# EAGLE board Led_Driver_90_B1 (EAGLE 6.4), part 1 of 2
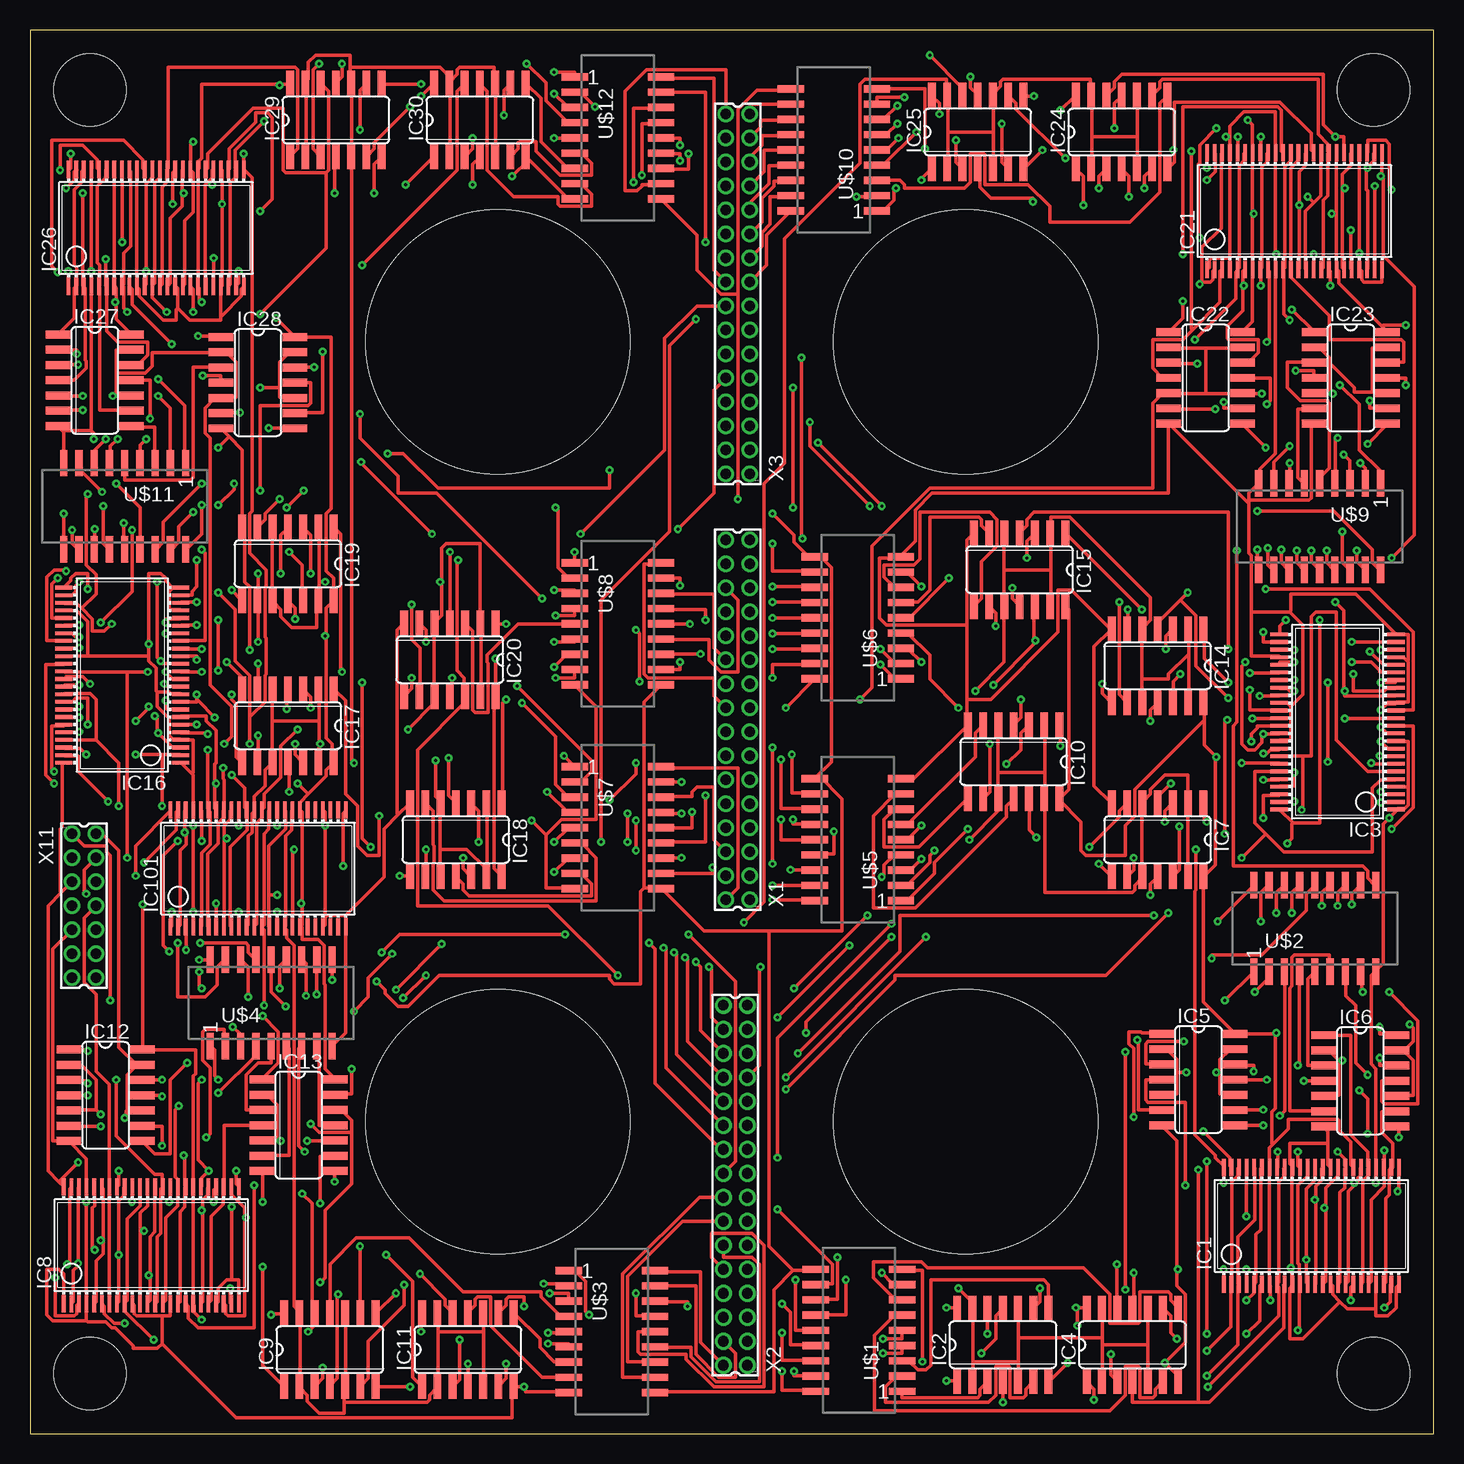
[diagram p10: board, top side]
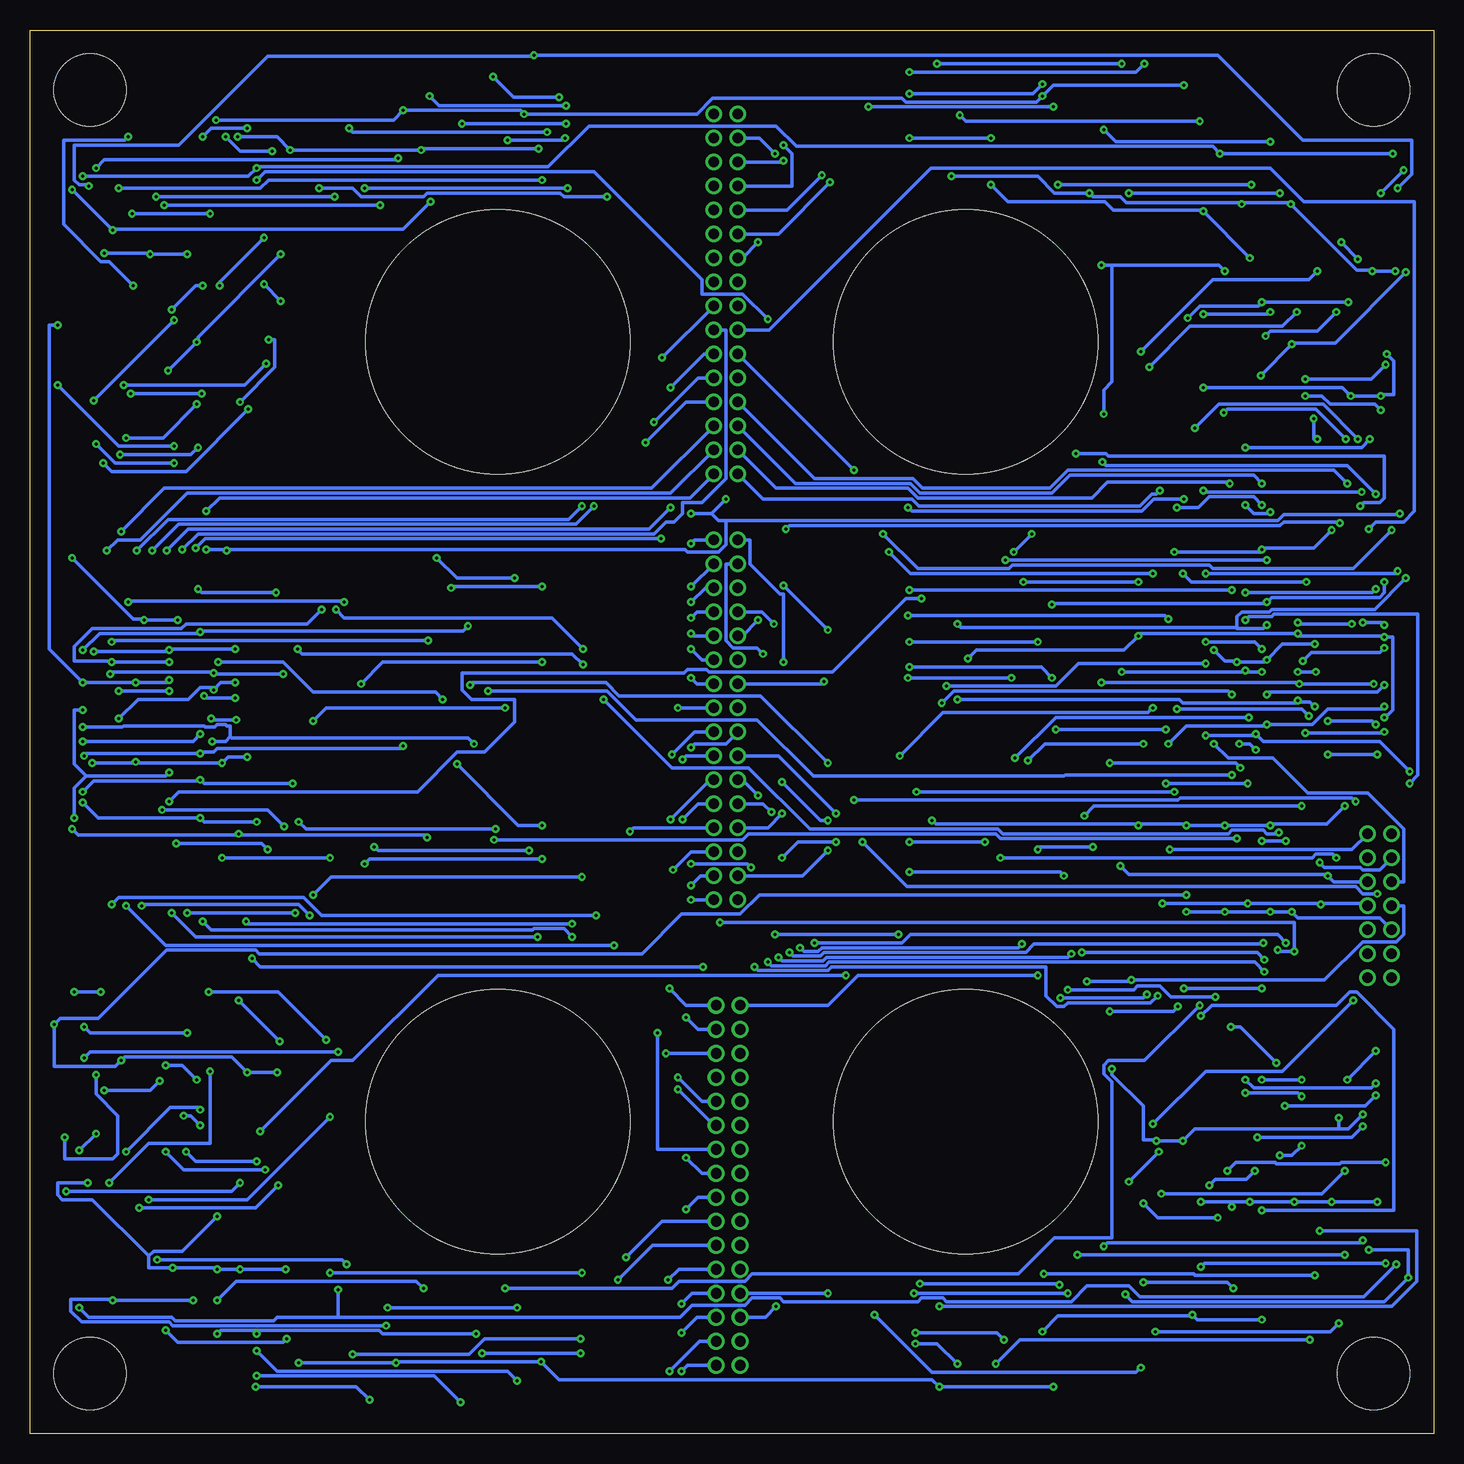
[diagram p11: board, bottom side, seen from below]

Size 117 x 117 mm. Coordinates in mm from the lower left corner, seen from the top.
Outline: 0,0 117,0 117,117 0,117 0,0
Copper layers (1*16): Top 0.1041mm / dielectric 1mm / Bottom 0.1041mm
Design rules "2_layer_board *": minimum track width 0.3mm, minimum drill 0.25mm, track to track 0.1mm, track to pad 0.1mm, pad to pad 0.1mm, via to via 0.2mm, smd to smd 0.1mm, copper to edge 1mm, drill to drill 0.2mm, minimum pad ring 10mil, minimum via ring 8mil, stop-mask expansion 4mil, vias tented up to drill 0mil, thermal gap 10mil
Holes 22 mm at 39,91 39,26 78,26 78,91
Holes 6 mm at 5,112 5,5 112,112 112,5

## Footprints (pad centres in the part's own frame; a part is rotated, then mirrored left to right if it is on the bottom)
SSOP48DL = smd 0.305 x 1.422: 1 -6.985,-4.877; 2 -6.35,-4.877; 3 -5.715,-4.877; 4 -5.08,-4.877; 5 -4.445,-4.877; 6 -3.81,-4.877; 7 -3.175,-4.877; 8 -2.54,-4.877; 9 -1.905,-4.877; 10 -1.27,-4.877; 11 -0.635,-4.877; 12 0,-4.877; 13 0.635,-4.877; 14 1.27,-4.877; 15 1.905,-4.877; 16 2.54,-4.877; 17 3.175,-4.877; 18 3.81,-4.877; 19 4.445,-4.877; 20 5.08,-4.877; 21 5.715,-4.877; 22 6.35,-4.877; 23 6.985,-4.877; 24 7.62,-4.877; 25 7.62,4.877; 26 6.985,4.877; 27 6.35,4.877; 28 5.715,4.877; 29 5.08,4.877; 30 4.445,4.877; 31 3.81,4.877; 32 3.175,4.877; 33 2.54,4.877; 34 1.905,4.877; 35 1.27,4.877; 36 0.635,4.877; 37 0,4.877; 38 -0.635,4.877; 39 -1.27,4.877; 40 -1.905,4.877; 41 -2.54,4.877; 42 -3.175,4.877; 43 -3.81,4.877; 44 -4.445,4.877; 45 -5.08,4.877; 46 -5.715,4.877; 47 -6.35,4.877; 48 -6.985,4.877
SO14 = smd 0.66 x 2.032: 1 -3.81,-3.073; 2 -2.54,-3.073; 3 -1.27,-3.073; 4 0,-3.073; 5 1.27,-3.073; 6 2.54,-3.073; 7 3.81,-3.073; 8 3.81,3.073; 9 2.54,3.073; 10 1.27,3.073; 11 0,3.073; 12 -1.27,3.073; 13 -2.54,3.073; 14 -3.81,3.073
SOP-18 = smd 0.6 x 2.2: 1 -5.08,-3.6; 2 -3.81,-3.6; 3 -2.54,-3.6; 4 -1.27,-3.6; 5 0,-3.6; 6 1.27,-3.6; 7 2.54,-3.6; 8 3.81,-3.6; 9 5.08,-3.6; 10 5.08,3.6; 11 3.81,3.6; 12 2.54,3.6; 13 1.27,3.6; 14 0,3.6; 15 -1.27,3.6; 16 -2.54,3.6; 17 -3.81,3.6; 18 -5.08,3.6
87758-3216 = drill 0.9 pad 1.27: 1 -15,-1; 2 -15,1; 3 -13,-1; 4 -13,1; 5 -11,-1; 6 -11,1; 7 -9,-1; 8 -9,1; 9 -7,-1; 10 -7,1; 11 -5,-1; 12 -5,1; 13 -3,-1; 14 -3,1; 15 -1,-1; 16 -1,1; 17 1,-1; 18 1,1; 19 3,-1; 20 3,1; 21 5,-1; 22 5,1; 23 7,-1; 24 7,1; 25 9,-1; 26 9,1; 27 11,-1; 28 11,1; 29 13,-1; 30 13,1; 31 15,-1; 32 15,1
87758-1416 = drill 0.9 pad 1.27: 1 -6,-1; 2 -6,1; 3 -4,-1; 4 -4,1; 5 -2,-1; 6 -2,1; 7 0,-1; 8 0,1; 9 2,-1; 10 2,1; 11 4,-1; 12 4,1; 13 6,-1; 14 6,1

## Placement (x,y rotation side)
IC1  74AC16374  [SSOP48DL]  106.5,17.3 0 top
IC2  74S08D  [SO14]  81.1,7.4 0 top
IC3  74AC16374  [SSOP48DL]  109,59 90 top
IC4  74S08D  [SO14]  91.9,7.4 0 top
IC5  74S08D  [SO14]  97.4,29.5 270 top
IC6  74S08D  [SO14]  110.9,29.4 270 top
IC7  74S08D  [SO14]  94,49.5 180 top
IC8  74AC16374  [SSOP48DL]  9.8,15.7 0 top
IC9  74S08D  [SO14]  25,7 0 top
IC10  74S08D  [SO14]  82,56 180 top
IC11  74S08D  [SO14]  36.5,7 0 top
IC12  74S08D  [SO14]  6.3,28.2 270 top
IC13  74S08D  [SO14]  22.4,25.7 270 top
IC14  74S08D  [SO14]  94,64 180 top
IC15  74S08D  [SO14]  82.5,72 180 top
IC16  74AC16374  [SSOP48DL]  7.7,62.9 90 top
IC17  74S08D  [SO14]  21.5,59 180 top
IC18  74S08D  [SO14]  35.5,49.5 180 top
IC19  74S08D  [SO14]  21.5,72.5 180 top
IC20  74S08D  [SO14]  35,64.5 180 top
IC21  74AC16374  [SSOP48DL]  105.1,101.9 0 top
IC22  74S08D  [SO14]  98,88 270 top
IC23  74S08D  [SO14]  110.1,88 270 top
IC24  74S08D  [SO14]  91,108.5 0 top
IC25  74S08D  [SO14]  79,108.5 0 top
IC26  74AC16374  [SSOP48DL]  10.2,100.5 0 top
IC27  74S08D  [SO14]  5.4,87.8 270 top
IC28  74S08D  [SO14]  19,87.6 270 top
IC29  74S08D  [SO14]  25.5,109.5 0 top
IC30  74S08D  [SO14]  37.5,109.5 0 top
IC101  74AC16374  [SSOP48DL]  18.7,47.1 0 top
U$1  ULN2804-SM  [SOP-18]  69.1,8.6 90 top
U$2  ULN2804-SM  [SOP-18]  107.1,42.1 0 top
U$3  ULN2804-SM  [SOP-18]  48.5,8.5 270 top
U$4  ULN2804-SM  [SOP-18]  20.1,35.9 0 top
U$5  ULN2804-SM  [SOP-18]  69,49.5 90 top
U$6  ULN2804-SM  [SOP-18]  69,68 90 top
U$7  ULN2804-SM  [SOP-18]  49,50.5 270 top
U$8  ULN2804-SM  [SOP-18]  49,67.5 270 top
U$9  ULN2804-SM  [SOP-18]  107.5,75.6 180 top
U$10  ULN2804-SM  [SOP-18]  67,107 90 top
U$11  ULN2804-SM  [SOP-18]  7.9,77.3 180 top
U$12  ULN2804-SM  [SOP-18]  49,108 270 top
X1  87758-3216  [87758-3216]  59,59.5 90 top
X2  87758-3216  [87758-3216]  58.8,20.7 90 top
X3  87758-3216  [87758-3216]  59,95 90 top
X11  87758-1416  [87758-1416]  4.5,44 270 top

## Tracks (layer width: path | path; a pad name or v marks a point on that pad's centre or on a via)
GND  (via drill 0.25)
  Top 0.3: IC26.39 8.9,105.3 8.9,95.7 IC26.10 9,95.5 9.1,95.4 9.1,94.8 11.1,92.8 12.2,92.8 12.2,93.7 12.3,93.8 | 12.3,93.8 12.3,95.5 12.2,95.6 IC26.15 | 12.3,93.8 13.3,92.8 15.9,92.8 15.9,93.2 | 15.9,93.2 15.9,95.6 IC26.21 16,95.7 v16,102.5 16,105.3 IC26.28 | IC26.24 17.8,95.6 17.6,95.4 17.6,94.8 16,93.2 15.9,93.2 | U$12.9 45.4,103 44.8,103 41.4,106.4 IC30.7 41.5,106.1 v40.2,104.8 | 2.8,83.5 2.4,83.9 IC27.7 | 2.8,83.5 2.8,80.9 U$11.9 | v3.2,96.9 3.2,95.7 IC26.1 | IC26.45 5.1,105.3 v5.1,96.9 5.1,95.7 IC26.4 5.1,95.5 5.1,83.6 | v11.9,102.5 11.9,105.1 12.1,105.3 IC26.34 | v28.7,103.4 28.7,105.8 29.3,106.4 IC29.7 | 5.1,83.6 2.9,83.6 2.8,83.5 | 24.7,43.1 24.8,43.2 26.3,43.2 | 24.7,43.1 24.6,43 24.6,42.4 24.5,42.3 IC101.21 | 26.3,43.2 26.3,42.3 IC101.24 26.3,42.1 26.3,33.4 25.2,32.3 U$4.9 | IC101.28 24.5,51.9 24.6,51.8 v24.6,50.7 24.6,43.2 24.7,43.1 | 30.7,51.6 29.5,50.4 29.5,46.4 26.3,43.2 | 30.7,51.6 31.6,52.5 IC18.7 | IC20.7 31.1,67.5 30.6,67 30.6,51.7 30.7,51.6 | 16.8,12.8 17.4,12.8 17.4,10.9 IC8.24 | 16.8,12.8 16.4,12.8 15.7,12.1 15.7,11 15.6,10.9 IC8.21 | v8.5,19.3 8.5,20.5 IC8.39 | v11.6,19.3 11.7,19.4 11.7,20.5 IC8.34 | v15.3,19.3 15.3,20.3 15.5,20.5 IC8.28 | v19.4,19.3 19.4,21.8 IC13.7 | v16.8,18.9 16.8,12.8 | 11,9.8 11.7,9.8 11.7,10.8 IC8.15 | 11,9.8 8.9,9.8 8.7,10 8.7,10.7 8.6,10.8 IC8.10 | 4.7,9.4 1.9,9.4 1.4,9.9 1.4,13.7 2.4,13.7 2.8,13.3 2.8,10.9 IC8.1 | 4.7,9.4 4.7,10.8 IC8.4 4.7,10.9 v4.7,19.3 4.7,20.5 IC8.45 4.7,20.6 4.7,22.9 3.3,24.3 IC12.7 3.1,24.4 1.9,24.4 1.9,40.4 X11.9 | 11,7.5 11,9.8 | 11,7.5 10.6,7.1 8.6,7.1 8.6,7.3 7.1,8.8 6.8,8.8 6.3,9.3 4.8,9.3 4.7,9.4 | 43,49.9 43,45.5 45.4,45.5 U$7.9
  Top 0.3: 43,49.9 44.3,51.2 47.2,51.2 47.2,60.6 45.4,62.4 U$8.9 | v11.8,43.5 11.8,42.3 IC101.1 | v17.4,43.5 17.4,42.3 IC101.10 | v20.6,43.5 20.6,42.3 IC101.15 | 16.6,83.1 16,83.7 IC28.7 | 16.6,83.1 17.7,82 17.7,75.6 IC19.7 17.8,75.5 17.9,75.4 17.9,71 18.3,70.6 v18.3,65.3 | v13.9,64.5 13.9,64.8 12.6,64.8 IC16.15 | v16.4,64.3 17.6,63.1 17.6,62.1 IC17.7 | 5.5,57.8 2.9,57.8 IC16.45 | 5.5,57.8 5.5,61.2 5,61.7 2.9,61.7 IC16.39 | 4.8,64.8 2.9,64.8 IC16.34 | 4.8,64.8 4.8,67.7 3.9,68.6 2.9,68.6 IC16.28 | 11.9,70.5 11.6,70.2 11.6,68.7 12.5,68.7 IC16.21 | 11.9,70.5 12.5,70.5 IC16.24 | IC101.4 13.6,42.3 v13.6,43.5 v13.6,50.7 13.6,51.9 IC101.45 13.6,52.1 13.6,54.9 13.5,55 | v17.4,50.7 17.4,51.9 IC101.39 | v20.6,50.7 20.6,51.9 IC101.34 | 13.5,55 12.6,55.9 IC16.1 | 13.5,55 13.6,55.1 13.6,57.8 12.6,57.8 IC16.4 12.5,57.9 11.9,57.9 11.6,58.2 11.6,59.6 10.6,60.6 10.6,61.8 | 10.6,61.8 11.6,61.8 11.7,61.7 12.5,61.7 IC16.10 | 11.9,70.5 11.3,71.1 11.3,71.3 10.9,71.7 9.9,71.7 v9.9,65.8 9.9,64.8 | 9.9,64.8 9.9,64.4 10.5,63.8 10.5,61.9 10.6,61.8 | 9.9,64.8 4.8,64.8 | 5.5,57.8 7.4,55.9 v7.4,52.3 | v41.8,51.1 43,49.9 | v5.3,82.9 5.3,83.4 5.1,83.6 | 16.6,83.1 v15.7,82.2 | v99.5,13.7 99.5,12.5 IC1.1 | v101.4,13.7 101.4,12.5 IC1.4 | v101.4,18.1 101.4,22.1 IC1.45 | 109.2,11 109.8,10.4 112.2,10.4 | 109.2,11 108.6,11.6 108.6,12.3 108.5,12.4 IC1.15 | 112.2,10.4 112.2,12.4 IC1.21 | 112.2,10.4 112.2,9.8 113.2,9.8 113.9,10.5 113.9,12.2 114.1,12.4 IC1.24 | 108.2,24.2 108.2,25.2 107.9,25.5 IC6.7 | 108.2,24.2 108.2,22.4 108.4,22.2 IC1.34 | 105.2,13.8 105.2,22.1 IC1.39 105.2,22.3 105,22.5 105,24.2 108.2,24.2 | 105.2,13.8 105.2,12.5 IC1.10 105.2,12.3 105,12.1 105,7.9 106.1,7.9 109.2,11
  Top 0.3: v105.1,13.8 105.2,13.8 | v31.7,3.9 28.9,3.9 IC9.7 | U$3.9 44.9,3.5 41.3,3.5 41.3,3.8 v41.2,3.9 40.4,3.9 IC11.7 40.2,3.9 40.2,1.3 17.2,1.3 11,7.5 | v86.5,5.9 85,4.4 IC2.7 | IC4.7 95.7,4.4 95.7,4.8 v94.6,5.9 96.3,7.6 96.3,11.6 95.6,12.3 95.6,13.7 | 95.6,13.7 95.6,24.4 94.4,25.6 IC5.7 | v74.4,6 74.4,13.6 72.7,13.6 U$1.9 | v95.7,13.7 95.6,13.7 | v105.4,55.1 105.4,54 104.2,54 IC3.45 | 114.9,53.9 113.9,53.9 IC3.4 | 114.9,53.9 114.9,52.4 114.6,52.1 114,52.1 IC3.1 113.8,52 113.8,51.8 v113.3,51.3 112.8,50.8 112.8,39.2 112.2,38.6 U$2.9 112.1,38.5 111.8,38.2 111.8,30.8 112.2,30.4 112.2,22.2 IC1.28 112.2,22.1 v112.2,20.9 | 114.9,53.9 114.9,57.7 113.9,57.7 IC3.10 | 95.4,107 95.4,106 94.9,105.5 IC24.7 | 95.4,107 95.4,111 104.2,111 106.8,108.4 106.8,107 107,106.8 IC21.34 | v84.4,107 82.9,105.5 IC25.7 | v95.3,107 95.4,107 | v74.6,107.1 74.6,112.1 70.6,112.1 U$10.9 | IC7.7 90.1,52.6 88.7,54 88.7,65.6 90.1,67 IC14.7 90,67.1 86.8,70.3 85.7,70.3 85.7,66.8 80.1,61.2 78.1,61.2 | U$5.9 72.6,54.6 73.7,54.6 78.1,59 IC10.7 78.1,59.1 78.1,61.2 | 78.1,61.2 78.1,67.4 | 78.1,67.4 78.1,74.5 78.6,75 IC15.7 | 78.1,67.4 71.4,67.4 70.8,68 70.8,73 72.6,73 U$6.9 72.6,73.2 73.8,74.4 73.8,77 75.2,78.4 94.9,78.4 94.9,84 IC22.7 95,84.1 101.5,77.6 101.6,77.6 | IC21.24 112.7,97 112.7,96 111.2,96 111,96.2 111,96.9 110.9,97 IC21.21 110.8,97.1 v110.8,98.4 110.8,106.7 IC21.28 | 100,98 98.5,98 98.3,97.8 98.3,97.2 98.2,97.1 IC21.1 | 100,98 100,97.1 IC21.4 | 100,98 100,106.7 IC21.45 100,106.9 100,108.1 | 103.8,98.3 103.8,106.7 IC21.39 103.8,106.9 103.8,110.2 101.2,110.2 100,109 100,108.1 | 103.8,98.3 103.8,97.1 IC21.10 103.8,96.9 103.8,81.7 102.5,80.4 102.5,79.3 U$9.9 102.4,79.2 101.6,78.4 101.6,77.8
  Top 0.3: v107,98.3 107,97.1 IC21.15 | v103.9,98.3 103.8,98.3 | 114.8,64.4 114.5,64.7 113.9,64.7 IC3.21 | 114.8,64.4 114.9,64.3 114.9,61 113.9,61 IC3.15 113.8,60.8 113.1,60.8 v112.6,60.3 | 114.8,64.4 114.9,64.5 114.9,66.6 113.9,66.6 IC3.24 113.8,66.7 110.5,70 105.1,70 105.1,68.6 105,68.5 | 105.1,60.6 105.1,57.8 104.2,57.8 IC3.39 | 105.1,60.6 104.8,60.9 104.2,60.9 IC3.34 | 101.8,68.5 101.8,73.2 101.6,73.4 101.6,77.6 | 101.8,68.5 101.8,64.8 104.1,64.8 IC3.28 | 101.6,77.8 101.6,77.6 | 101.6,77.8 106.6,77.8 106.8,78 106.8,83.9 107,84.1 IC23.7 | 105.1,60.6 106.1,61.6 106.1,67.4 105,68.5 | 101.8,68.5 105,68.5 | 100,108.1 v99.7,108.1
  Bottom 0.3: v3.2,96.9 v5.1,96.9 5.2,97 6.4,97 v11.9,102.5 12,102.6 16,102.6 | 16,102.6 25.6,102.6 26.1,103.1 28.4,103.1 v28.7,103.4 31.6,103.4 33,104.8 v40.2,104.8 | v16,102.5 16,102.6 | 16.8,19.3 v15.3,19.3 v11.6,19.3 v8.5,19.3 v4.7,19.3 | 16.8,19.3 v19.4,19.3 | 16.8,19.3 v16.8,18.9 | X11.9 4.5,43 11.3,43 v11.8,43.5 v13.6,43.5 v17.4,43.5 v20.6,43.5 | v7.4,52.3 8.9,50.8 13.5,50.8 v13.6,50.7 v17.4,50.7 v20.6,50.7 20.7,50.8 24.6,50.8 | v9.9,65.8 12.6,65.8 v13.9,64.5 14.1,64.3 v16.4,64.3 16.5,64.4 17.4,64.4 v18.3,65.3 | v41.8,51.1 41.5,50.8 24.6,50.8 | v24.6,50.7 24.6,50.8 | v5.3,82.9 6,82.2 v15.7,82.2 | v101.4,18.1 104.3,15.2 106.7,15.2 107.1,14.8 | 107.1,14.8 107.1,13.8 v105.1,13.8 101.5,13.8 v101.4,13.7 v99.5,13.7 v95.7,13.7 | v31.7,3.9 v41.2,3.9 41.8,4.5 72.9,4.5 v74.4,6 86.4,6 v86.5,5.9 v94.6,5.9 | v105.4,55.1 105.7,54.8 112.3,54.8 | 112.3,54.8 113.3,53.8 v113.3,51.3 | v74.6,107.1 84.3,107.1 v84.4,107 v95.3,107 96.4,108.1 v99.7,108.1 | v103.9,98.3 v107,98.3 107.1,98.4 v110.8,98.4 | 112.3,54.8 113.3,55.8 113.3,60.3 v112.6,60.3 | 107.1,14.8 111.8,19.5 114.3,19.5 114.7,19.9 114.7,20.9 v112.2,20.9
N$2  (via drill 0.25)
  Top 0.3: IC1.46 100.7,22.1 100.7,21.5 100.2,21 100.2,12.5 IC1.2 100.1,12.3 100.1,8.9 v98.1,6.9 | v76.4,4.4 77.2,4.4 IC2.1
  Bottom 0.3: v76.4,4.4 77.2,5.2 96.4,5.2 v98.1,6.9
N$3  (via drill 0.25)
  Top 0.3: IC1.44 102.1,22.1 102.1,17.8 100.7,16.4 100.7,12.5 IC1.3 100.7,12.3 100.7,7.4 v98.1,4.8 | v81.1,2.6 IC2.4
  Bottom 0.3: v81.1,2.6 83.3,4.8 v98.1,4.8
N$4  (via drill 0.25)
  Top 0.3: IC1.43 102.6,22.1 102.6,17 102.2,16.6 102.2,12.6 102.1,12.5 IC1.5 102,12.3 102,11.7 v101.4,11.1 | v84.2,12.1 84.2,11 83.7,10.5 IC2.9
  Bottom 0.3: v84.2,12.1 84.8,12.7 99.8,12.7 v101.4,11.1
N$5  (via drill 0.25)
  Top 0.3: v101.4,8.3 102.5,9.4 102.5,12.3 102.6,12.4 IC1.6 | v79.8,8.3 79.8,10.4 IC2.12 | v104,23.5 104,22.2 IC1.41 | v98.1,8.3 v98.1,22.7
  Bottom 0.3: v101.4,8.3 101.1,8.6 98.1,8.6 | 98.1,8.6 87.9,8.6 87.6,8.3 v79.8,8.3 | v104,23.5 103.2,22.7 v98.1,22.7 | 98.1,8.6 v98.1,8.3
N$6  (via drill 0.25)
  Top 0.3: IC1.40 104.5,22.1 104.5,21.4 104.1,21 104.1,12.6 104,12.5 IC1.8 104,12.3 104.1,12.2 104.1,9.8 v98.2,3.9 | v88.7,2.8 88.7,3.7 88.1,4.3 IC4.1
  Bottom 0.3: v88.7,2.8 89.8,3.9 v98.2,3.9
N$7  (via drill 0.25)
  Top 0.3: 97.4,2.6 91.9,2.6 IC4.4 | 97.4,2.6 98.3,2.6 104.5,8.8 104.5,12.4 IC1.9 | v105.7,23.5 105.7,22.3 105.8,22.2 IC1.38 | 97.4,2.6 v97.4,22
  Bottom 0.3: v105.7,23.5 104.2,22 v97.4,22
N$8  (via drill 0.25)
  Top 0.3: IC1.37 106.5,21.5 105.7,20.7 105.7,14.2 105.8,14.1 105.8,12.5 IC1.11 105.8,12.3 105.8,8.7 v105.7,8.6 | v95.6,7.9 95.1,8.4 95.1,9.8 94.5,10.4 IC4.9
  Bottom 0.3: v95.6,7.9 95.9,7.6 104.7,7.6 v105.7,8.6
N$9  (via drill 0.25)
  Top 0.3: IC1.12 106.5,12.5 106.4,12.6 v106.4,14.5 106.4,20.4 107.1,21.1 107.1,22.1 IC1.36 | v90.6,14.1 90.6,10.5 IC4.12
  Bottom 0.3: v90.6,14.1 91,14.5 v106.4,14.5
N$10  (via drill 0.25)
  Top 0.3: 107.2,19.5 107.2,20.6 107.7,21.1 107.7,22.1 IC1.35 | 107.2,19.5 107.2,12.5 IC1.13 | v92,26.4 92,32.1 91.6,32.5 91.6,33.5 92.6,33.5 92.7,33.4 94.3,33.4 IC5.1 | v107.1,19.5 107.2,19.5
  Bottom 0.3: v92,26.4 98.9,19.5 v107.1,19.5
N$11  (via drill 0.25)
  Top 0.3: 108,18.8 108,20.5 109,21.5 109,22.1 IC1.33 | 108,18.8 108,12.7 107.8,12.5 IC1.14 | IC5.4 93,29.5 93,27.8 93.2,27.6 96.3,27.6 v96.3,20.7 | v107.9,18.8 108,18.8
  Bottom 0.3: v96.3,20.7 98.2,18.8 v107.9,18.8
N$12  (via drill 0.25)
  Top 0.3: IC1.16 109.1,12.5 109.2,12.6 109.2,20.1 109.6,20.5 109.6,22.1 IC1.32 109.6,22.3 109.6,22.9 v109,23.5 | v102.8,27 100.5,27 IC5.9
  Bottom 0.3: v102.8,27 103,27.2 105.3,27.2 v109,23.5
N$13  (via drill 0.25)
  Top 0.3: 110.5,20.8 110.7,21 110.7,21.3 110.9,21.5 110.9,22.1 IC1.30 | 110.5,20.8 109.9,20.2 109.9,12.7 109.7,12.5 IC1.17 | v102,30.2 102,30.7 100.5,30.7 IC5.12 | v110.4,20.9 110.5,20.8
  Bottom 0.3: v102,30.2 102,24.2 107.1,24.2 v110.4,20.9
N$14
  Top 0.3: IC1.19 111,12.5 111.1,12.6 111.1,21.1 111.5,21.5 111.5,22.1 IC1.29 111.5,22.3 111.5,23.5 110.1,24.9 110.1,33.2 107.9,33.2 IC6.1
N$15  (via drill 0.25)
  Top 0.3: IC1.20 111.6,12.5 111.8,12.7 111.8,19.5 112.9,20.6 112.9,22.1 IC1.27 112.9,22.3 v112.9,23.6 | v106.2,29.4 IC6.4 | v110.8,28.6 111.5,27.9 v111.5,25
  Bottom 0.3: v106.2,29.4 107,28.6 v110.8,28.6 | v112.9,23.6 v111.5,25
N$16
  Top 0.3: IC1.22 112.9,12.5 113,12.6 113,19.6 113.3,19.9 113.3,22 113.4,22.1 IC1.26 113.6,22.2 113.6,24.2 112.7,25.1 112.7,26.8 113.9,26.8 IC6.9
N$17  (via drill 0.25)
  Top 0.3: v62.7,5.2 62.7,3.6 65.5,3.6 U$1.18
  Bottom 0.3: v62.7,5.2 62.2,5.7 X2.1
N$19
  Top 0.3: U$1.1 72.7,3 79,3 79.2,3.2 79.2,3.7 79.8,4.3 IC2.3
N$20
  Top 0.3: IC2.6 83.6,4.3 83,3.7 83,3.2 82.8,3 81.7,3 81.7,5.5 81.6,5.6 80.5,5.6 80.5,3.2 79.9,2.6 71.3,2.6 71.3,3.9 72.1,4.7 72.7,4.7 U$1.2
N$21
  Top 0.3: IC2.8 84.9,10.5 84.9,12.4 84.5,12.8 75.1,12.8 75.1,5.7 74.7,5.3 74,5.3 73.3,6 72.7,6 U$1.3
N$22  (via drill 0.25)
  Top 0.3: v79.3,6.7 80.5,7.9 80.5,9.8 81.1,10.4 IC2.11 | v71.1,6.7 72.7,6.7 U$1.4
  Bottom 0.3: v71.1,6.7 v79.3,6.7
N$23  (via drill 0.25)
  Top 0.3: v90.1,6.6 90.1,4.9 90.6,4.4 IC4.3 | v71.1,7.9 72.7,7.9 U$1.5
  Bottom 0.3: v90.1,6.6 80.4,6.6 79.1,7.9 v71.1,7.9
N$24  (via drill 0.25)
  Top 0.3: v92,13.4 92,10.6 91.9,10.5 IC4.11 | v71,13.4 71.9,12.5 72.7,12.5 U$1.8
  Bottom 0.3: v71,13.4 v92,13.4
N$25
  Top 0.3: IC4.8 95.7,10.5 95.1,11.1 95.1,11.6 94.9,11.8 92.5,11.8 92.5,9.3 92.4,9.2 90,9.2 90,11.6 87.8,13.8 74.8,13.8 74.3,14.3 70.3,14.3 70.3,13 72.1,11.2 72.7,11.2 U$1.7
N$26
  Top 0.3: IC4.6 94.4,4.3 93.8,3.7 93.8,3.2 93.6,3 92.5,3 92.5,5.5 92.4,5.6 91.3,5.6 91.3,3.2 90,1.9 70.4,1.9 70.4,8.2 72,9.8 72.7,9.8 U$1.6
N$27  (via drill 0.25)
  Top 0.3: v96.2,32.7 93.2,32.7 93,32.5 93,30.8 94.3,30.8 IC5.3 | v99.6,36.1 102,38.5 U$2.1
  Bottom 0.3: v99.6,36.1 v96.2,32.7
N$28  (via drill 0.25)
  Top 0.3: v92.3,32.8 92.4,32.7 92.4,27 94.3,27 IC5.6 | v102.1,36.8 103.2,37.9 103.2,38.5 U$2.2
  Bottom 0.3: v92.3,32.8 96.3,36.8 v102.1,36.8
N$29  (via drill 0.25)
  Top 0.3: v102.8,25.7 100.5,25.7 IC5.8 | v104.2,26.5 104.6,26.9 104.6,38.5 U$2.3
  Bottom 0.3: v102.8,25.7 103.6,26.5 v104.2,26.5
N$30  (via drill 0.25)
  Top 0.3: IC6.11 112.7,29.4 112.7,27.7 112.9,27.5 115.7,27.5 115.7,34.4 v113.3,36.8 | v111.1,36.8 111,36.9 111,38.5 U$2.8
  Bottom 0.3: v111.1,36.8 v113.3,36.8
N$31  (via drill 0.25)
  Top 0.3: v114.1,24.7 114.1,25.4 114,25.5 IC6.8 | v111.5,29.9 110.5,30.9 110.5,35.7 109.7,36.5 109.7,38.5 U$2.7
  Bottom 0.3: v114.1,24.7 114.1,22.9 110.1,22.9 109.7,23.3 109.7,26.5 111.5,28.3 v111.5,29.9
N$32
  Top 0.3: IC6.6 107.8,26.9 105,26.9 105,37.1 105.2,37.3 105.2,39.7 105.4,39.9 108.3,39.9 108.3,38.5 U$2.6
N$33
  Top 0.3: U$2.5 106.5,37.9 106.5,30.7 107.8,30.7 IC6.3
N$34  (via drill 0.25)
  Top 0.3: v103.1,29.5 IC5.11 | v105.7,30.7 105.8,30.8 105.8,38.5 U$2.4
  Bottom 0.3: v103.1,29.5 104.3,30.7 v105.7,30.7
N$35  (via drill 0.25)
  Top 0.3: 108.3,86.8 107.1,86.8 IC23.5 | 108.3,89.2 108.3,89.7 107.5,90.5 107.1,90.5 IC23.2 | 108.3,89.2 108.3,86.8 | 111.9,86.8 110.4,86.8 110.4,87.2 108.4,89.2 108.3,89.2 | 111.9,86.8 113.1,86.8 IC23.10 | 111.9,86.8 111.9,90.5 113.1,90.5 IC23.13 | 13,50.1 13,50.3 12.9,50.4 12.9,51.9 IC101.46 | 13,50.1 13,49.1 12.5,48.6 12.5,42.4 12.4,42.3 IC101.2 | 98,86.7 101,86.7 IC22.10 101.2,86.7 v102.7,86.7 | 98,86.7 95,86.7 IC22.5 94.8,86.7 94.4,86.7 93.6,85.9 93.6,78.8 75,78.8 70.2,74 70.2,62.2 v69.2,61.2 | 98,90.5 101,90.5 IC22.13 | 98,90.5 95,90.5 IC22.2 | 98,90.5 98,86.7 | v12.9,50.1 13,50.1 | v108.6,86.7 108.4,86.7 108.3,86.8
  Bottom 0.3: v12.9,50.1 13,50 13.9,50 14.2,50.3 16.8,50.3 17.1,50 35.9,50 36.3,50.4 52,50.4 57.1,55.5 63.5,55.5 v69.2,61.2 | v102.7,86.7 v108.6,86.7
N$36  (via drill 0.25)
  Top 0.3: v13,40.3 13,42.2 IC101.3 | v11.6,40.2 11.1,40.7 11.1,48.2 v12.3,49.4 | v14.3,49.4 14.3,51.9 IC101.44 | 76.5,108.5 76.5,111.5 IC25.13 76.4,111.7 76.4,112.9 69.6,112.9 69.2,112.5 69.2,105.9 62.9,99.6 62.9,80.9 61.2,79.2 61.2,44.3 v59.5,42.6 | 76.5,108.5 76.5,105.5 IC25.2 | 80.3,108.5 80.3,111.5 IC25.10 80.3,111.7 80.9,112.3 80.9,112.7 81.1,112.9 88.4,112.9 88.4,111.7 IC24.13 88.5,111.5 88.5,108.1 | 80.3,108.5 80.3,105.5 IC25.5 | 80.3,108.5 76.5,108.5 | 88.5,108.1 88.5,105.5 IC24.2 | 92.3,108.1 92.3,111.5 IC24.10 | 92.3,108.1 92.3,105.5 IC24.5 | 92.3,108.1 88.5,108.1
  Bottom 0.3: v13,40.3 12.9,40.2 v11.6,40.2 11.6,42.6 v59.5,42.6 | v14.3,49.4 v12.3,49.4
N$39  (via drill 0.25)
  Top 0.3: IC8.2 3.5,10.9 3.6,11 3.6,13.6 4,14 v4,14.2 4,20.5 IC8.46 | v19.4,13.9 19.4,5.7 21.1,4 IC9.1
  Bottom 0.3: v19.4,13.9 19.1,14.2 v4,14.2
N$40  (via drill 0.25)
  Top 0.3: v2.1,13 2.1,9.8 3.7,9.8 3.9,10 3.9,10.7 4,10.8 IC8.3 | v5.4,15.3 5.2,15.5 5.2,18.8 5.4,19 5.4,20.5 IC8.44 | v25.7,11.6 25.6,11.5 25.6,4.6 25,4 IC9.4
  Bottom 0.3: v5.4,15.3 2.1,15.3 v2.1,13 4.1,11 25.1,11 v25.7,11.6
N$41  (via drill 0.25)
  Top 0.3: 6.1,16.1 6.1,20.4 6,20.5 IC8.43 | 6.1,16.1 6.1,15 5.5,14.4 5.5,11 5.4,10.9 IC8.5 | v27.5,15.6 27.5,10.1 IC9.9 | v5.9,16.1 6.1,16.1
  Bottom 0.3: v27.5,15.6 27.2,15.9 6.1,15.9 v5.9,16.1
N$42  (via drill 0.25)
  Top 0.3: v7.9,9.2 7,9.2 6.2,10 6.2,10.6 6,10.8 IC8.6 | 23.6,8.9 23.7,9 23.7,10 IC9.12 | 23.6,8.9 v23.2,8.5 | v7.4,21.9 7.4,20.7 7.3,20.6 IC8.41 | v22.7,20 23.5,19.2 23.5,9 23.6,8.9
  Bottom 0.3: v7.9,9.2 8.6,8.5 v23.2,8.5 | v7.4,21.9 9.3,20 v22.7,20
N$43  (via drill 0.25)
  Top 0.3: IC8.8 7.3,10.9 7.4,11 v7.4,14.9 7.4,19.4 7.8,19.8 7.8,20.5 IC8.40 | v29.7,14.9 31.9,12.7 31.9,4.7 32.6,4 IC11.1
  Bottom 0.3: v7.4,14.9 v29.7,14.9
N$44  (via drill 0.25)
  Top 0.3: IC8.38 9.2,20.5 9.2,19 8.1,17.9 8.1,11.1 7.9,10.9 IC8.9 7.9,10.7 7.9,10.2 v10.3,7.8 | v36.5,5.8 IC11.4
  Bottom 0.3: v36.5,5.8 34.5,7.8 v10.3,7.8
N$45  (via drill 0.25)
  Top 0.3: 9.2,16.9 9.2,18.4 9.8,19 IC8.37 | 9.2,16.9 9.2,10.9 IC8.11 | v41.2,10.6 41.2,11.4 39.9,11.4 39.7,11.2 39.7,10.7 39.1,10.1 IC11.9 | 9.2,16.9 v9.5,16.9
  Bottom 0.3: v41.2,10.6 3.5,10.6 1.4,12.7 1.4,16.9 v9.5,16.9
N$46  (via drill 0.25)
  Top 0.3: 10,13.2 10,16.4 10.4,16.8 10.4,20.5 IC8.36 | 10,13.2 10,11.1 9.8,10.9 IC8.12 | v32.5,13.3 34.6,11.2 34.6,10.7 35.2,10.1 IC11.12 | v9.9,13.2 10,13.2
  Bottom 0.3: v32.5,13.3 20,13.3 19.9,13.2 v9.9,13.2
N$47  (via drill 0.25)
  Top 0.3: IC8.13 10.5,10.9 10.6,11 10.6,16.4 10.9,16.7 10.9,20.4 11,20.5 IC8.35 11,20.7 11,21.6 10.4,21.6 7.2,24.8 v7.2,29.5 | v4.8,31.9 4.8,32 3.3,32 IC12.1
  Bottom 0.3: v7.2,29.5 v4.8,31.9
N$48  (via drill 0.25)
  Top 0.3: IC8.14 11.1,10.9 11.3,11.1 11.3,18 12.3,19 12.3,20.5 IC8.33 12.3,20.7 12.3,21.2 12.1,21.4 12.1,27 v12.4,27.3 | v4.8,28.2 IC12.4
  Bottom 0.3: v4.8,28.2 5.7,27.3 v12.4,27.3
N$49  (via drill 0.25)
  Top 0.3: IC8.16 12.4,10.9 12.5,11 12.5,18.5 12.9,18.9 12.9,20.5 IC8.32 12.9,20.7 12.9,23.1 v12.8,23.2 | v11,24 11,25.6 9.4,25.6 IC12.9
  Bottom 0.3: v11,24 11.8,23.2 v12.8,23.2
N$50  (via drill 0.25)
  Top 0.3: v18.7,20.7 18.7,8.8 14,8.8 13.2,9.6 13.2,10.6 13,10.8 IC8.17 | IC8.30 14.3,20.6 14.3,21.3 v14.9,21.9 14,22.8 14,29.2 v14.3,29.5 | v11,29.5 9.4,29.5 IC12.12
  Bottom 0.3: v18.7,20.7 18.2,21.2 15.6,21.2 v14.9,21.9 | v14.3,29.5 v11,29.5
N$51  (via drill 0.25)
  Top 0.3: 14.4,18.6 14.4,19.5 14.8,19.9 14.8,20.5 IC8.29 | 14.4,18.6 14.4,11 14.3,10.9 IC8.19 | v19.4,34.8 20.7,33.5 20.7,30.9 19.4,29.6 IC13.1 | v14.3,18.6 14.4,18.6
  Bottom 0.3: v19.4,34.8 18.5,35.7 8.1,35.7 7,36.8 6.4,36.8 3.3,33.7 3.3,18.6 v14.3,18.6
N$52
  Top 0.3: IC8.20 14.9,10.9 15.1,11.1 15.1,18.1 16.1,19.1 16.1,20.5 IC8.27 16.2,20.7 16.2,25.7 IC13.4
N$53  (via drill 0.25)
  Top 0.3: 17.9,18 17.9,18.8 16.8,19.9 16.8,20.5 IC8.26 | 17.9,18 17.9,9.8 16.5,9.8 16.3,10 16.3,10.7 16.2,10.8 IC8.22 | v24.2,19.2 24.2,23.1 25.4,23.1 IC13.9 | v18,18 17.9,18
  Bottom 0.3: v24.2,19.2 23,18 v18,18
N$56  (via drill 0.25)
  Top 0.3: v24.4,5.5 24.4,4.6 23.8,4 IC9.3 | v46.6,9.9 46.3,10.2 46.3,12.7 45.5,13.5 44.9,13.5 U$3.1
  Bottom 0.3: v24.4,5.5 24.8,5.1 41.8,5.1 v46.6,9.9
N$57  (via drill 0.25)
  Top 0.3: v31.2,12.4 31.2,10.7 28.2,7.7 28.2,4.6 27.6,4 IC9.6 | v42.8,12.5 44.9,12.5 U$3.2
  Bottom 0.3: v31.2,12.4 31.3,12.5 v42.8,12.5
N$58  (via drill 0.25)
  Top 0.3: v30.5,11.7 28.9,10.1 IC9.8 | v43.3,11.7 44.9,11.7 U$3.3
  Bottom 0.3: v43.3,11.7 v30.5,11.7
N$59
  Top 0.3: IC9.11 25,14.1 27.2,16.3 31.6,16.3 36.1,11.8 42.6,11.8 42.6,11.4 44.2,9.8 44.9,9.8 U$3.4
N$60  (via drill 0.25)
  Top 0.3: v35.8,7.8 35.8,4.5 35.3,4 IC11.3 | v43.2,8.4 44.9,8.4 U$3.5
  Bottom 0.3: v35.8,7.8 36.4,8.4 v43.2,8.4
N$61
  Top 0.3: IC11.11 36.5,10.1 37.1,10.7 37.1,11.2 37.3,11.4 38.4,11.4 38.4,9 42.7,4.7 U$3.8
N$62
  Top 0.3: IC11.8 40.4,10 42.5,7.9 42.5,7.2 43.7,6 44.9,6 U$3.7
N$63  (via drill 0.25)
  Top 0.3: v39.7,5.8 39.7,4.6 39.1,4 IC11.6 | v43.2,7.5 44.9,7.5 U$3.6
  Bottom 0.3: v39.7,5.8 41.4,7.5 v43.2,7.5
N$64  (via drill 0.25)
  Top 0.3: v4.8,29.2 4.8,29.4 3.3,29.4 IC12.3 | v15.7,29.5 15.4,29.8 15.4,32 15.1,32.3 U$4.1
  Bottom 0.3: v4.8,29.2 5.2,28.8 15,28.8 v15.7,29.5
N$65  (via drill 0.25)
  Top 0.3: v5.9,25.6 3.3,25.6 IC12.6 | v14.7,24.7 15,25 15,30.5 14.4,31.1 14.4,33.5 14.6,33.7 16.2,33.7 16.2,32.3 U$4.2
  Bottom 0.3: v5.9,25.6 6.8,24.7 v14.7,24.7
N$66  (via drill 0.25)
  Top 0.3: v13.1,30.9 11.7,29.5 11.7,23.3 10.4,23.3 9.4,24.3 IC12.8 | v16.9,33.9 17.5,33.3 17.5,32.3 U$4.3
  Bottom 0.3: v13.1,30.9 16.1,33.9 v16.9,33.9
N$67
  Top 0.3: IC13.11 24.1,25.7 24.1,32.2 24,32.3 U$4.8
N$68  (via drill 0.25)
  Top 0.3: v25.4,21 25.4,21.8 IC13.8 | v22.9,23.5 22.4,24 22.4,32.1 22.6,32.3 U$4.7
  Bottom 0.3: v22.9,23.5 v25.4,21
N$69
  Top 0.3: IC13.6 19.4,23.2 21.6,23.2 21.6,32.1 21.4,32.3 U$4.6
N$70
  Top 0.3: U$4.5 20.1,30.9 19,30.9 18,29.9 18,27 19.3,27 IC13.3
N$71  (via drill 0.25)
  Top 0.3: IC12.11 11,28.2 v11,28.1 | v15.7,28.4 18.8,31.5 18.8,32.3 U$4.4
  Bottom 0.3: v11,28.1 11.3,28.4 v15.7,28.4
N$72  (via drill 0.25)
  Top 0.3: v3.1,14.1 3.3,14.3 3.3,20.4 3.4,20.5 IC8.47 | v112.9,10.5 113.4,11 113.4,12.4 IC1.23 | v112.5,31.3 112.5,30.7 113.9,30.7 IC6.12 | v91.3,12 v91.3,31.8
  Bottom 0.3: v3.1,14.1 5.8,11.4 24.5,11.4 25.4,12.3 28.9,12.3 30.2,11 40.6,11 40.9,11.3 42.7,11.3 43,11 54.2,11 54.5,11.3 56.8,11.3 57.4,10.7 61.8,10.7 62.8,9.7 91.3,9.7 | 91.3,9.7 96.4,9.7 96.7,9.4 104.9,9.4 105.2,9.7 112.1,9.7 v112.9,10.5 | v112.5,31.3 112,31.8 v91.3,31.8 | 91.3,9.7 v91.3,12
N$75  (via drill 0.25)
  Top 0.3: v63.7,5.2 63.7,4.8 U$1.17
  Bottom 0.3: v63.7,5.2 61.2,7.7 X2.3
N$76  (via drill 0.25)
  Top 0.3: v62.7,8.4 62.7,6.1 65.5,6.1 U$1.16
  Bottom 0.3: v62.7,8.4 61.4,9.7 X2.5
N$77  (via drill 0.25)
  Top 0.3: v62.7,10.8 63.4,10.1 63.4,7.4 65.5,7.4 U$1.15
  Bottom 0.3: v62.7,10.8 61.8,11.7 X2.7
N$78  (via drill 0.25)
  Top 0.3: U$1.14 63.8,8.6 v63.8,12.8
  Bottom 0.3: v63.8,12.8 62.9,13.7 X2.9
N$79  (via drill 0.25)
  Top 0.3: v68,12.8 68,9.9 65.5,9.9 U$1.13
  Bottom 0.3: v68,12.8 65.1,15.7 X2.11
N$80  (via drill 0.25)
  Top 0.3: v67.3,14.7 67.3,11.2 65.5,11.2 U$1.12
  Bottom 0.3: v67.3,14.7 64.3,17.7 X2.13
N$81  (via drill 0.25)
  Top 0.3: v62.3,18.7 66.9,14.1 66.9,12.5 65.5,12.5 U$1.11
  Bottom 0.3: v62.3,18.7 61.3,19.7 X2.15
N$82  (via drill 0.25)
  Top 0.3: v99,42.7 102,45.7 U$2.18 | v71.8,42.5 62.3,33 v62.3,23
  Bottom 0.3: v99,42.7 98.8,42.5 v71.8,42.5 | v62.3,23 61,21.7 X2.17
N$83  (via drill 0.25)
  Top 0.3: v102.6,42.7 102.6,45.1 103.2,45.7 U$2.17 | v71.8,41.4 64.7,34.3 v64.7,33.4
  Bottom 0.3: v102.6,42.7 101.9,42 75.1,42 75,42.1 72.5,42.1 v71.8,41.4 | v64.7,33.4 64.7,23.7 X2.19
N$84  (via drill 0.25)
  Top 0.3: v103.9,43.4 103.9,45.1 104.5,45.7 U$2.16 | v94.9,43.4 89.7,38.2 72.1,38.2 72.1,37.8 v63,28.7
  Bottom 0.3: v94.9,43.4 v103.9,43.4 | v63,28.7 60,25.7 X2.21
N$85  (via drill 0.25)
  Top 0.3: v105.2,43.4 105.2,45.1 105.8,45.7 U$2.15 | v63,29.7 v74.7,41.4
  Bottom 0.3: v105.2,43.4 103.2,41.4 v74.7,41.4 | v63,29.7 61,27.7 X2.23
N$86  (via drill 0.25)
  Top 0.3: U$2.14 106.4,45 106.4,43.6 102.7,39.9 98.5,39.9 v98.5,39.6 | v60.9,38.9 60.8,38.8 60.8,30.7 X2.25
  Bottom 0.3: v98.5,39.6 97.8,38.9 v60.9,38.9
N$87  (via drill 0.25)
  Top 0.3: v107.7,44 107.7,45.1 108.3,45.7 U$2.13 | v93.7,43.2 72.5,43.2 72.5,40.2 v64,31.7
  Bottom 0.3: v107.7,44 107.6,44.1 94.6,44.1 v93.7,43.2 | X2.27 v64,31.7
N$88  (via drill 0.25)
  Top 0.3: v109,44 109,45.1 109.6,45.7 U$2.12 | v62.3,34.7 v68.3,40.7
  Bottom 0.3: v109,44 105.7,40.7 v68.3,40.7 | v62.3,34.7 61.3,33.7 X2.29
N$89  (via drill 0.25)
  Top 0.3: v110.2,44.1 110.2,45 U$2.11 | v63.7,37.1 v69.8,43.2
  Bottom 0.3: v110.2,44.1 109.6,44.7 94.2,44.7 92.7,43.2 v69.8,43.2 | v63.7,37.1 62.3,35.7 X2.31
N$90  (via drill 0.25)
  Top 0.3: v23.9,36.6 U$4.11 | v33,38.2 v31.1,36.3
  Bottom 0.3: v23.9,36.6 24.2,36.3 v31.1,36.3 | v33,38.2 48,38.2 50.5,35.7 X2.32
N$91  (via drill 0.25)
  Top 0.3: v23,36.5 23,39.2 22.7,39.5 U$4.12 | v56.6,38.9 56.8,38.7 56.8,34.7 X2.30
  Bottom 0.3: v23,36.5 23.6,35.9 30.5,35.9 30.8,35.6 31.4,35.6 32.3,36.5 32.3,38.9 50.2,38.9 50.5,38.6 56.3,38.6 v56.6,38.9
N$92  (via drill 0.25)
  Top 0.3: v20.8,37.1 20.8,39 21.3,39.5 U$4.13 | v14.3,37.1 14.1,37.3 v14.1,38.5 | v55.5,39.3 55.9,38.9 55.9,33.6 X2.28
  Bottom 0.3: v14.3,37.1 v20.8,37.1 | v14.1,38.5 14.9,39.3 50.4,39.3 50.7,39 55.2,39 v55.5,39.3
N$93  (via drill 0.25)
  Top 0.3: U$4.14 20.1,36.8 v21.3,35.6 | v27,35.2 28.2,36.4 28.2,38 v30.2,40 | v54.6,39.7 54.8,39.5 54.8,32.7 X2.26
  Bottom 0.3: v21.3,35.6 21.7,35.2 v27,35.2 | v30.2,40 30.5,39.7 50.6,39.7 50.9,39.4 54.3,39.4 v54.6,39.7
N$94  (via drill 0.25)
  Top 0.3: v14.2,40.9 18,40.9 18.2,40.7 18.2,40.1 18.8,39.5 U$4.15 | v53.7,40.1 53.9,39.9 53.9,31.6 X2.24
  Bottom 0.3: v14.2,40.9 14.3,40.8 33.3,40.8 34,40.1 50.8,40.1 51.1,39.8 53.4,39.8 v53.7,40.1
N$95  (via drill 0.25)
  Top 0.3: v18.2,36.4 18.2,38.9 17.6,39.5 U$4.16 | v34.3,40.8 v30.5,37 | v52.8,40.5 53,40.3 53,30.5 X2.22
  Bottom 0.3: v18.2,36.4 21.9,36.4 22.8,37.3 24.7,37.3 25,37 v30.5,37 | v34.3,40.8 34.6,40.5 51,40.5 51.3,40.2 52.5,40.2 v52.8,40.5
N$96  (via drill 0.25)
  Top 0.3: v12.3,40.9 12.3,36.4 14.6,36.4 15.6,37.4 15.6,38.9 16.2,39.5 U$4.17 | v51.6,40.9 52.1,40.4 52.1,29.2 57.6,23.7 X2.20
  Bottom 0.3: v12.3,40.9 13,41.6 43.6,41.6 44.3,40.9 v51.6,40.9
N$97  (via drill 0.25)
  Top 0.3: v14.1,39.5 U$4.18 | v29.3,40.1 30.8,41.6 v44.6,41.6 | v54.9,41.6 58.8,37.7 58.8,22.7 X2.18
  Bottom 0.3: v14.1,39.5 14.7,40.1 v29.3,40.1 | v54.9,41.6 v44.6,41.6
N$98
  Top 0.3: X2.16 55.8,19.7 49.4,13.3 49.4,4.7 U$3.11
N$99
  Top 0.3: X2.14 54.4,17.7 49.8,13.1 49.8,6 52.1,6 U$3.12
N$100
  Top 0.3: X2.12 57.8,14.7 60.2,14.7 60.8,14.1 60.8,4.3 57.2,4.3 55.1,6.4 55.1,7.2 52.1,7.2 U$3.13
N$101
  Top 0.3: U$3.14 50.7,8.5 50.7,6.8 50.9,6.6 54.7,6.6 54.7,6.2 57,3.9 61.2,3.9 61.2,15.7 60.2,16.7 56.8,16.7 56.8,14.7 X2.10
N$102  (via drill 0.25)
  Top 0.3: v50.5,11.7 50.5,9.8 52.1,9.8 U$3.15
  Bottom 0.3: X2.8 v50.5,11.7
N$103  (via drill 0.25)
  Top 0.3: v54.8,10.6 54.8,11 52.1,11 U$3.16
  Bottom 0.3: v54.8,10.6 55.7,9.7 X2.6
N$104
  Top 0.3: X2.4 58.8,6.7 58.8,4.7 57.4,4.7 55.5,6.6 55.5,12.3 U$3.17
N$105
  Top 0.3: X2.2 55.9,7.6 55.9,13.5 52.1,13.5 U$3.18
N$107  (via drill 0.25)
  Top 0.3: v102.8,51.3 102.8,53.2 104.1,53.2 IC3.46 | v98.1,51 97.9,51.2 97.9,52.5 IC7.1 | v112.6,52.6 113.8,52.6 IC3.2
  Bottom 0.3: v98.1,51 102.5,51 v102.8,51.3 111.3,51.3 v112.6,52.6
N$108  (via drill 0.25)
  Top 0.3: v102.8,54.5 104.1,54.5 IC3.44 | v95.1,54.2 94,53.1 IC7.4 | v112.6,53.5 112.6,53.3 113.8,53.3 IC3.3
  Bottom 0.3: v95.1,54.2 102.5,54.2 v102.8,54.5 102.9,54.4 111.7,54.4 v112.6,53.5
N$109  (via drill 0.25)
  Top 0.3: 103,50 104.5,48.5 111.9,48.5 111.9,53.8 112.6,54.5 113.8,54.5 IC3.5 | 103,50 102.1,50.9 102.1,55.2 104.1,55.2 IC3.43 | v92,48 92,47 91.5,46.5 IC7.9 | 103,50 v101,48
  Bottom 0.3: v101,48 v92,48
N$110  (via drill 0.25)
  Top 0.3: 106.1,56.5 106.8,56.5 106.8,68.1 107.2,68.5 108.9,68.5 108.9,57.8 111.5,55.2 113.8,55.2 IC3.6 | 106.1,56.5 104.2,56.5 IC3.41 | v95.8,50.6 95.8,47 95.3,46.5 IC7.12 | v106,52 106.1,52.1 106.1,56.5
  Bottom 0.3: v95.8,50.6 97.2,52 v106,52
N$111  (via drill 0.25)
  Top 0.3: v112.5,56.5 113.8,56.5 IC3.8 | v102.8,56.7 103.1,56.7 103.4,57 104.1,57 IC3.40 | v85.9,57.3 85.9,59 IC10.1
  Bottom 0.3: v112.5,56.5 112.3,56.7 v102.8,56.7 102.7,56.8 101.7,56.8 101.4,57.1 86.1,57.1 v85.9,57.3
N$112  (via drill 0.25)
  Top 0.3: v112.6,57.7 113.2,57.1 113.8,57.1 IC3.9 | IC3.38 104.1,58.3 v102.8,58.3 102.7,58.2 102.7,57.6 102.1,57 101.5,57 101,57.5 101,64 v101.3,64.3 | v82.6,61.2 82.6,59.7 82,59.1 IC10.4
  Bottom 0.3: v102.8,58.3 103.4,57.7 v112.6,57.7 | v82.6,61.2 83.2,61.8 93.4,61.8 95.9,64.3 v101.3,64.3
N$113  (via drill 0.25)
  Top 0.3: IC3.37 102.3,59 102.3,58.8 101.8,58.3 v101.8,57.7 | v112.6,58.9 113.1,58.4 113.8,58.4 IC3.11 | v80,57.5 80,53.5 79.5,53 IC10.9
  Bottom 0.3: v101.8,57.7 100.7,57.7 100.3,58.1 | 100.3,58.1 100.3,59 100.6,59 100.7,59.1 101.4,59.1 101.6,58.9 102.4,58.9 102.5,59 109.2,59 109.3,58.9 v112.6,58.9 | v80,57.5 80.5,58 100.2,58 100.3,58.1
N$114  (via drill 0.25)
  Top 0.3: IC3.12 115.3,59 115.3,52.2 v113.5,50.4 | v83.9,49.7 83.3,50.3 83.3,52.9 IC10.12 | v101.9,59.6 104.1,59.6 IC3.36 | v99.8,59.5 99.6,59.3 v99.6,50
  Bottom 0.3: v113.5,50.4 113,49.9 99.6,49.9 | 99.6,49.9 84.1,49.9 v83.9,49.7 | v101.9,59.6 101.8,59.5 v99.8,59.5 | v99.6,50 99.6,49.9
N$115  (via drill 0.25)
  Top 0.3: v101.7,62 101.7,60.3 104.1,60.3 IC3.35 | v99.9,62.6 97.9,64.6 97.9,67 IC14.1 | v109.6,59.6 113.8,59.6 IC3.13
  Bottom 0.3: v99.9,62.6 101.1,62.6 v101.7,62 101.7,62.2 102.8,62.2 103.8,61.2 108,61.2 v109.6,59.6
N$116  (via drill 0.25)
  Top 0.3: v103,70.4 111.7,70.4 115.3,66.8 115.3,60.3 113.9,60.3 IC3.14 | 95.9,69.5 94,67.6 IC14.4 | 95.9,69.5 v96.5,70.1 | v102.5,61.5 104.1,61.5 IC3.33 | v99.9,61.3 97.2,64 97.2,68.2 95.9,69.5
  Bottom 0.3: v103,70.4 102.7,70.1 v96.5,70.1 | v102.5,61.5 102.3,61.3 v99.9,61.3
N$117  (via drill 0.25)
  Top 0.3: v105.4,61.9 105,61.9 104.8,62.1 104.2,62.1 IC3.32 | IC3.16 113.8,61.5 109.6,61.5 v109.6,61.9 109.5,62 109.5,68.6 v108.8,69.3 | v90.8,69.3 90.8,61.6 91.4,61 IC14.9
  Bottom 0.3: v105.4,61.9 v109.6,61.9 | v90.8,69.3 90.9,69.4 108.7,69.4 v108.8,69.3
N$118  (via drill 0.25)
  Top 0.3: v101.7,63.4 104.1,63.4 IC3.30 | v95.9,63.3 95.3,62.7 95.3,61 IC14.12 | v110.3,63.3 110.3,61.9 112.9,61.9 113.1,62.1 113.8,62.1 IC3.17
  Bottom 0.3: v95.9,63.3 101.6,63.3 v101.7,63.4 101.8,63.5 110.1,63.5 v110.3,63.3
N$119  (via drill 0.25)
  Top 0.3: v110.2,64.3 111.8,64.3 112.5,63.6 112.5,63.5 113.8,63.5 IC3.19 | v105.4,64.3 104.2,64.3 104.2,64.1 IC3.29 | v92.7,68.7 86.4,75 IC15.1
  Bottom 0.3: v105.4,64.3 v110.2,64.3 110.3,64.4 113.3,64.4 113.3,65.6 111.8,67.1 104.4,67.1 104,67.5 93.9,67.5 v92.7,68.7
N$120  (via drill 0.25)
  Top 0.3: v105.4,65.3 104.2,65.3 IC3.27 | v111.7,65.2 112.8,64.1 113.8,64.1 IC3.20 | v99.9,65.4 99.9,76.8 83.7,76.8 83.1,76.2 83.1,75.7 82.5,75.1 IC15.4
  Bottom 0.3: v111.7,65.2 105.5,65.2 v105.4,65.3 105.3,65.4 v99.9,65.4
N$121  (via drill 0.25)
  Top 0.3: v102.8,66.8 102.8,66 104.1,66 IC3.26 | v112.6,65.3 113.8,65.3 IC3.22 | v80.5,67.3 80.5,68.4 80,68.9 IC15.9
  Bottom 0.3: v112.6,65.3 111.2,66.7 102.9,66.7 v102.8,66.8 102.7,66.9 80.9,66.9 v80.5,67.3
N$123  (via drill 0.25)
  Top 0.3: v94.6,51 94.6,51.9 95.2,52.5 IC7.3 | v78.2,50.4 75.4,47.6 75.4,46.7 73.2,44.5 72.6,44.5 U$5.1
  Bottom 0.3: v94.6,51 94,50.4 v78.2,50.4
N$124  (via drill 0.25)
  Top 0.3: v88.3,48.9 90.8,51.4 90.8,51.9 91.4,52.5 IC7.6 | v75.4,48.6 75,48.2 75,47.6 73.1,45.7 U$5.2
  Bottom 0.3: v88.3,48.9 88,48.6 v75.4,48.6
N$125  (via drill 0.25)
  Top 0.3: v89.1,47.5 90.1,46.5 IC7.8 | v74.3,47.9 73.4,47 72.6,47 U$5.3
  Bottom 0.3: v89.1,47.5 88.7,47.9 v74.3,47.9
N$126  (via drill 0.25)
  Top 0.3: v93.4,44.9 93.4,45.8 94,46.4 IC7.11 | v71,46.4 71.2,46.6 71.2,47.4 72,48.2 72.6,48.2 U$5.4
  Bottom 0.3: v93.4,44.9 91.9,46.4 v71,46.4
N$127  (via drill 0.25)
  Top 0.3: v81.4,55.8 82.6,57 82.6,58.4 83.2,59 IC10.3 | v74.3,50.7 73.1,49.5 U$5.5
  Bottom 0.3: v81.4,55.8 76.3,50.7 v74.3,50.7
N$128
  Top 0.3: IC10.11 82,52.9 81.4,52.3 81.4,51.4 73.8,43.8 70.3,43.8 70.3,51.5 72.1,53.3 U$5.8
N$129
  Top 0.3: IC10.8 78.1,52.9 74.1,48.9 71.2,48.9 71.2,51.2 72,52 72.6,52 U$5.7
N$130
  Top 0.3: IC10.6 79.4,59 78.8,58.4 78.8,56.4 73.2,50.8 72.6,50.8 U$5.6
N$131  (via drill 0.25)
  Top 0.3: v94.7,65.4 94.7,66.5 95.2,67 IC14.3 | v70.9,64.1 72,63 72.6,63 U$6.1
  Bottom 0.3: v94.7,65.4 94.3,65 71.8,65 v70.9,64.1
N$132  (via drill 0.25)
  Top 0.3: v91.5,68.7 91.5,67.1 IC14.6 | v70.9,65.4 72.1,64.2 U$6.2
  Bottom 0.3: v91.5,68.7 90.8,68 73.5,68 v70.9,65.4
N$133  (via drill 0.25)
  Top 0.3: v89.4,62.5 89.4,61.7 90.1,61 IC14.8 | v74.3,64.3 73.2,65.4 72.6,65.4 U$6.3
  Bottom 0.3: v89.4,62.5 87.6,64.3 v74.3,64.3
N$134  (via drill 0.25)
  Top 0.3: v81.9,70.5 81.9,69.6 82.5,69 IC15.11 | v74.3,70.6 73.1,71.8 U$6.8
  Bottom 0.3: v81.9,70.5 81.8,70.6 v74.3,70.6
N$135
  Top 0.3: IC15.8 78.7,69 79.3,69.6 79.3,72.7 80.6,74 80.6,76.2 80,76.8 74.2,76.8 74.2,72.9 73.7,72.4 71.2,72.4 71.2,71.4 72,70.6 72.6,70.6 U$6.7
N$136
  Top 0.3: IC15.6 79.9,75.1 79.3,75.7 79.3,76.2 79.1,76.4 75,76.4 75,70.3 74,69.3 72.6,69.3 U$6.6
N$137  (via drill 0.25)
  Top 0.3: v83.1,73 83.1,74.4 83.7,75 IC15.3 | v76.6,71.3 73.3,68 U$6.5
  Bottom 0.3: v83.1,73 81.4,71.3 v76.6,71.3
N$138  (via drill 0.25)
  Top 0.3: v93.4,59.4 93.4,60.3 94,60.9 IC14.11 | v77.4,60.5 75,62.9 75,64.9 73.2,66.7 72.6,66.7 U$6.4
  Bottom 0.3: v93.4,59.4 92.3,60.5 v77.4,60.5
N$143  (via drill 0.25)
  Top 0.3: v8.8,56.6 11,56.6 | 11,56.6 12.5,56.6 IC16.2 | v4.7,56.6 4.2,57.1 2.9,57.1 IC16.46 | v29.1,51.5 29.1,48.2 28.1,48.2 27.3,49 27.3,52.3 26.3,53.3 26.3,61.1 25.4,62 IC17.1 | 11,56.6 v11,52.3
  Bottom 0.3: v4.7,56.6 v8.8,56.6 | v29.1,51.5 28.3,52.3 v11,52.3
N$144  (via drill 0.25)
  Top 0.3: v4.1,58.5 2.9,58.5 IC16.44 | IC16.3 12.5,57.2 11.9,57.2 v10.7,58.4 10.6,58.5 10.6,59.6 v10.4,59.8 | v21.4,60.4 21.4,61.9 21.5,62 IC17.4
  Bottom 0.3: v4.1,58.5 4.2,58.4 v10.7,58.4 | v21.4,60.4 11,60.4 v10.4,59.8
N$145  (via drill 0.25)
  Top 0.3: v14.8,58.3 14.8,58.4 12.6,58.4 IC16.5 | v19,58.2 19,56 IC17.9 | v2,55.2 1.8,55.4 1.8,59 2.8,59 IC16.43
  Bottom 0.3: v19,58.2 14.9,58.2 v14.8,58.3 14.2,57.7 4.5,57.7 v2,55.2
N$146  (via drill 0.25)
  Top 0.3: v4.1,60.6 4.1,60.4 2.9,60.4 IC16.41 | v13.9,59.1 12.6,59.1 IC16.6 | v22.1,57.5 22.1,56.6 22.7,56 IC17.12
  Bottom 0.3: v4.1,60.6 4.3,60.4 8.8,60.4 10.1,59.1 v13.9,59.1 14,59 20.6,59 v22.1,57.5
N$147  (via drill 0.25)
  Top 0.3: v11.3,61.1 11.4,61 11.4,60.4 12.5,60.4 IC16.8 | v39.7,61.2 39.4,60.9 39.4,52.6 IC18.1 | v4.8,59.1 4.8,61.3 3.8,61.3 3.5,61 2.9,61 IC16.40 | v8.8,59.4 9.9,60.5 v9.9,60.6
  Bottom 0.3: v39.7,61.2 21.2,61.2 20.9,60.9 11.5,60.9 v11.3,61.1 11.2,61 10.3,61 v9.9,60.6 | v4.8,59.1 5.1,59.4 v8.8,59.4
N$148  (via drill 0.25)
  Top 0.3: 13.9,61 12.6,61 IC16.9 | v13.9,61.6 13.9,61 | v4.1,62.4 2.9,62.4 2.9,62.3 IC16.38 | v34.9,56.3 34.9,53.2 35.5,52.6 IC18.4 | v15.4,59.7 14,61.1 13.9,61
  Bottom 0.3: v13.9,61.6 13.7,61.8 4.7,61.8 v4.1,62.4 | v34.9,56.3 31.5,59.7 v15.4,59.7
N$149  (via drill 0.25)
  Top 0.3: v11.2,62.5 11.2,62.3 12.5,62.3 IC16.11 | v5,62.5 4.4,63.1 3,63.1 3,63 2.9,62.9 IC16.37 | v33,48.7 33,46.5 IC18.9 | v28.4,48.9 27.7,49.6 v27.7,62.6
  Bottom 0.3: v5,62.5 v11.2,62.5 11.3,62.6 v27.7,62.6 | v33,48.7 32.8,48.9 v28.4,48.9
N$150  (via drill 0.25)
  Top 0.3: v9.8,63.5 8.1,63.5 | 8.1,63.5 2.9,63.5 IC16.36 | v11.3,63.5 11.9,62.9 IC16.12 | v36.1,48 36.1,47.1 36.7,46.5 IC18.12 | 8.1,63.5 v8.1,48
  Bottom 0.3: v11.3,63.5 v9.8,63.5 | v36.1,48 10.1,48 9.8,48.3 8.4,48.3 v8.1,48
N$151  (via drill 0.25)
  Top 0.3: v14.3,63.5 12.6,63.5 IC16.13 | v26,63.5 25.9,63.6 25.9,75 25.4,75.5 IC19.1 | v2,54.2 1.3,54.9 1.3,64.1 2.8,64.1 IC16.35 | v15.7,63.6 v15.7,67.8
  Bottom 0.3: v26,63.5 15.7,63.5 | 15.7,63.5 v14.3,63.5 | v2,54.2 1.3,54.9 1.3,68.3 13.3,68.3 13.5,68.1 15.4,68.1 v15.7,67.8 | v15.7,63.6 15.7,63.5
N$152  (via drill 0.25)
  Top 0.3: v4.1,65.5 2.9,65.5 IC16.33 | IC16.14 12.5,64.2 10.9,64.2 v10.9,64.4 10.6,64.7 v10.6,71 | v20.9,71.7 20.9,74.9 21.5,75.5 IC19.4
  Bottom 0.3: v10.9,64.4 10.2,65.1 4.5,65.1 v4.1,65.5 | v20.9,71.7 20.2,71 v10.6,71
N$153  (via drill 0.25)
  Top 0.3: v14.3,65.4 12.6,65.4 IC16.16 | v19,66 19,69.4 IC19.9 19,69.5 v19,71.7 | v3,71.9 3,72 2,72 1.4,71.4 1.4,66.1 2.8,66.1 IC16.32
  Bottom 0.3: v14.3,65.4 14.9,66 v19,66 | v3,71.9 3.2,71.7 v19,71.7
N$154  (via drill 0.25)
  Top 0.3: v14.3,73.7 14.6,73.4 14.6,66.1 12.6,66.1 IC16.17 | v21.6,73.5 22.7,72.4 22.7,69.5 IC19.12 | v4.1,67.4 2.9,67.4 IC16.30 | v5.9,67.6 8.5,70.2 v8.5,75.3
  Bottom 0.3: v21.6,73.5 14.5,73.5 v14.3,73.7 14.2,73.8 10,73.8 v8.5,75.3 | v4.1,67.4 4.3,67.6 v5.9,67.6
N$155  (via drill 0.25)
  Top 0.3: v2.3,71.3 1.8,70.8 1.8,68 2.8,68 IC16.29 | v13.9,67.4 12.6,67.4 IC16.19 | v39.7,67.5 38.9,67.5 IC20.1
  Bottom 0.3: v2.3,71.3 4.9,68.7 13.5,68.7 13.7,68.5 16,68.5 16.4,68.1 16.4,67.2 | 16.4,67.2 16.4,67.1 14.2,67.1 v13.9,67.4 | v39.7,67.5 39.4,67.2 16.4,67.2
N$156  (via drill 0.25)
  Top 0.3: v11.3,67.6 11.3,67.9 12.5,67.9 IC16.20 | v6.8,67.5 6.2,66.9 5.2,66.9 5.2,67.9 4.3,68.8 | 4.3,68.8 3.9,69.2 2.9,69.2 IC16.27 | v35,73.5 IC20.4 | v33.5,75 27.6,80.9 v27.6,81 | v4.8,78.3 4.7,78.2 4.7,72.4 5.5,71.6 5.5,70 4.3,68.8
  Bottom 0.3: v11.3,67.6 11.2,67.5 v6.8,67.5 | v33.5,75 v35,73.5 | v27.6,81 27.3,80.7 7.2,80.7 v4.8,78.3
N$157  (via drill 0.25)
  Top 0.3: v13.9,69.3 12.6,69.3 IC16.22 | v4.1,71 3.8,70.7 3.8,70.2 3.5,69.9 2.9,69.9 IC16.26 | v31.8,69.1 31.8,66.2 32.5,65.5 32.5,61.5 IC20.9
  Bottom 0.3: v4.1,71 4.1,70.1 4.5,69.7 13.5,69.7 v13.9,69.3 14,69.2 31.7,69.2 v31.8,69.1
N$158  (via drill 0.25)
  Top 0.3: v13.9,72.8 13.9,70.6 13.5,70.2 13.5,69.9 12.6,69.9 IC16.23 | v35.7,72.8 35.6,72.7 35.6,63.6 36.2,63 36.2,61.5 IC20.12 36.2,61.3 36.2,60.9 32.3,57 32.3,44 43.2,44 v49,38.2 | v97.8,25.2 100,23 100,22.3 100.1,22.2 IC1.47
  Bottom 0.3: v35.7,72.8 v13.9,72.8 | v97.8,25.2 91.9,31.1 90.1,31.1 83,38.2 v49,38.2
N$160  (via drill 0.25)
  Top 0.3: v23.4,60.5 23.4,61.4 22.8,62 IC17.3 | v44.5,56.5 45.4,55.6 U$7.1
  Bottom 0.3: v23.4,60.5 23.8,60.1 40.9,60.1 v44.5,56.5
N$161  (via drill 0.25)
  Top 0.3: v19,64.2 19,62.1 IC17.6 | v40.6,62.3 46.8,56.1 46.8,55.2 46,54.4 45.4,54.4 U$7.2
  Bottom 0.3: v19,64.2 29.6,64.2 31.5,62.3 v40.6,62.3
N$162  (via drill 0.25)
  Top 0.3: v16.8,61.6 16.8,61.2 17.2,60.8 17.2,56.4 17.6,56 IC17.8 | v41,60.9 43.8,58.1 43.8,54.1 44.8,53.1 45.4,53.1 U$7.3
  Bottom 0.3: v16.8,61.6 17.1,61.9 40,61.9 v41,60.9
N$163  (via drill 0.25)
  Top 0.3: v21.6,53.5 21.6,55.8 21.5,55.9 IC17.11 | v43.1,53.5 44.8,51.8 45.4,51.8 U$7.4
  Bottom 0.3: v43.1,53.5 v21.6,53.5
N$164  (via drill 0.25)
  Top 0.3: v37.4,49.3 37.4,51.9 36.8,52.5 IC18.3 | v43.7,49.3 44.9,50.5 U$7.5
  Bottom 0.3: v43.7,49.3 v37.4,49.3
N$165
  Top 0.3: IC18.11 35.5,46.4 36.1,45.8 36.1,45.3 36.6,44.8 46.8,44.8 46.8,45.8 46,46.6 45.4,46.6 U$7.8
N$166  (via drill 0.25)
  Top 0.3: v30.8,46.5 31.6,46.5 IC18.8 | v43.7,46.8 44.8,47.9 45.4,47.9 U$7.7
  Bottom 0.3: v30.8,46.5 31.1,46.8 v43.7,46.8
N$167
  Top 0.3: IC18.6 33,52.5 33.6,51.9 33.6,49.1 33.7,49 33.7,47.6 33.6,47.5 33.6,45.3 34.5,44.4 47.2,44.4 47.2,48 46,49.2 45.4,49.2 U$7.6
N$168  (via drill 0.25)
  Top 0.3: v23.4,71.7 23.4,74.9 22.8,75.5 IC19.3 | U$8.1 v45.4,73.5
  Bottom 0.3: v23.4,71.7 43.6,71.7 v45.4,73.5
N$169  (via drill 0.25)
  Top 0.3: v20.8,77.9 19.6,76.7 19.6,76.2 19,75.6 IC19.6 | v43.8,77.2 44,77 44,72.2 44.8,71.4 45.4,71.4 U$8.2
  Bottom 0.3: v20.8,77.9 23.3,77.9 24.3,76.9 43.5,76.9 v43.8,77.2
N$170  (via drill 0.25)
  Top 0.3: v16.8,70.3 17.6,69.5 IC19.8 | v43.7,70.3 45.4,70.3 U$8.3
  Bottom 0.3: v43.7,70.3 v16.8,70.3
N$171  (via drill 0.25)
  Top 0.3: v35.2,63 35.2,61.7 35,61.5 IC20.11 | v43.8,63 45.4,63 U$8.8
  Bottom 0.3: v43.8,63 v35.2,63
N$172  (via drill 0.25)
  Top 0.3: v31.8,63 31.8,62.1 31.2,61.5 IC20.8 | v43.7,63.9 44.7,64.9 45.4,64.9 U$8.7
  Bottom 0.3: v31.8,63 32.7,63.9 v43.7,63.9
N$173  (via drill 0.25)
  Top 0.3: v33,66 33,67 32.5,67.5 IC20.6 | v43.7,66 45.4,66 U$8.6
  Bottom 0.3: v43.7,66 v33,66
N$174
  Top 0.3: U$8.5 40.7,67.5 38.1,64.9 38.1,64.3 38.2,64.2 38.2,60.1 37.1,60.1 36.9,60.3 36.9,66.9 36.3,67.5 IC20.3
N$175  (via drill 0.25)
  Top 0.3: v22.1,67.9 22.1,68.8 21.5,69.4 IC19.11 | v43.8,68.2 45.4,68.2 U$8.4
  Bottom 0.3: v22.1,67.9 22.4,68.2 v43.8,68.2
N$176  (via drill 0.25)
  Top 0.3: v6.5,52.7 4,55.2 4,56.5 2.9,56.5 IC16.47 | v48.3,52.8 50.5,55 v50.5,55.9 | v80.3,62.4 83.7,65.8 83.7,66.1 | 83.7,66.1 83.7,68.9 IC15.12 | v110.2,66 113.8,66 IC3.23 | v83.8,66.1 83.7,66.1
  Bottom 0.3: v6.5,52.7 6.8,53 21.1,53 21.3,52.8 v48.3,52.8 | v50.5,55.9 56.1,61.5 67.9,61.5 69,62.6 80.1,62.6 v80.3,62.4 | v110.2,66 110.1,66.1 v83.8,66.1
N$179  (via drill 0.25)
  Top 0.3: v61.9,44.5 65.4,44.5 U$5.18
  Bottom 0.3: X1.1 v61.9,44.5
N$180  (via drill 0.25)
  Top 0.3: v61.9,45.7 U$5.17
  Bottom 0.3: v61.9,45.7 61.1,46.5 X1.3
N$181  (via drill 0.25)
  Top 0.3: v63.4,47 65.4,47 U$5.16
  Bottom 0.3: v63.4,47 61.9,48.5 X1.5
N$182  (via drill 0.25)
  Top 0.3: v67,50.2 67,48.3 65.4,48.3 U$5.15
  Bottom 0.3: v67,50.2 66.7,50.5 X1.7
N$183  (via drill 0.25)
  Top 0.3: U$5.14 62.6,49.5 v62.6,51.2
  Bottom 0.3: v62.6,51.2 61.3,52.5 X1.9
N$184  (via drill 0.25)
  Top 0.3: v63.6,51.2 63.6,50.8 65.4,50.8 U$5.13
  Bottom 0.3: v63.6,51.2 60.3,54.5 X1.11
N$185  (via drill 0.25)
  Top 0.3: v62.6,56.2 62.6,52.1 65.4,52.1 U$5.12
  Bottom 0.3: v62.6,56.2 62.3,56.5 X1.13
N$186  (via drill 0.25)
  Top 0.3: v63.5,56.6 63.5,53.4 65.4,53.4 U$5.11
  Bottom 0.3: v63.5,56.6 61.6,58.5 X1.15
N$187  (via drill 0.25)
  Top 0.3: v63,60.5 65.4,62.9 U$6.18
  Bottom 0.3: X1.17 v63,60.5
N$188  (via drill 0.25)
  Top 0.3: v61.9,63 61.9,64.1 65.4,64.1 U$6.17
  Bottom 0.3: v61.9,63 61.4,62.5 X1.19
N$189  (via drill 0.25)
  Top 0.3: v61.9,65.4 65.4,65.4 U$6.16
  Bottom 0.3: v61.9,65.4 61,64.5 X1.21
N$190  (via drill 0.25)
  Top 0.3: v61.9,66.7 65.4,66.7 U$6.15
  Bottom 0.3: v61.9,66.7 61.7,66.5 X1.23
N$191  (via drill 0.25)
  Top 0.3: v61.9,68 U$6.14
  Bottom 0.3: v61.9,68 61.4,68.5 X1.25
N$192  (via drill 0.25)
  Top 0.3: v61.9,69.3 65.4,69.3 U$6.13
  Bottom 0.3: v61.9,69.3 60.7,70.5 X1.27
N$193  (via drill 0.25)
  Top 0.3: v61.9,70.6 65.4,70.6 U$6.12
  Bottom 0.3: X1.29 v61.9,70.6
N$194  (via drill 0.25)
  Top 0.3: v61.9,74.2 61.9,71.9 65.4,71.9 U$6.11
  Bottom 0.3: v61.9,74.2 61.6,74.5 X1.31
N$195  (via drill 0.25)
  Top 0.3: v54.2,64.3 54.2,63.7 U$8.11
  Bottom 0.3: v54.2,64.3 54.2,70 54.5,70 57,72.5 57,74.5 X1.32
N$196  (via drill 0.25)
  Top 0.3: v55.9,65 52.6,65 U$8.12
  Bottom 0.3: v55.9,65 56.4,65.5 58.4,65.5 59,66.1 59,72.5 X1.30
N$197
  Top 0.3: X1.28 59,69.5 59,63.5 57.6,63.5 56.6,64.5 56.6,66.2 52.6,66.2 U$8.13
N$198  (via drill 0.25)
  Top 0.3: v55,67.5 U$8.14
  Bottom 0.3: v55,67.5 56,68.5 X1.26
N$199  (via drill 0.25)
  Top 0.3: v56.3,67.8 56.3,68.7 52.6,68.7 U$8.15
  Bottom 0.3: v56.3,67.8 57.6,66.5 X1.24
N$200
  Top 0.3: X1.22 57,65.5 57,70 52.6,70 U$8.16
N$201  (via drill 0.25)
  Top 0.3: v54.2,70.7 54.2,71.3 U$8.17 | v50.5,67 50.8,66.7 v50.8,62.7
  Bottom 0.3: v50.5,67 v54.2,70.7 | v50.8,62.7 51,62.5 X1.20
N$202
  Top 0.3: X1.18 57,61.5 57,63 51.5,63 51.2,63.3 51.2,72.5 52.6,72.5 U$8.18
N$203  (via drill 0.25)
  Top 0.3: v56.9,47.2 56.9,46.7 U$7.11 | v61.9,57.2 v61.9,47.5
  Bottom 0.3: v56.9,47.2 57.2,47.5 v61.9,47.5 | v61.9,57.2 61.6,57.5 59,57.5 X1.16
N$204  (via drill 0.25)
  Top 0.3: v54.3,48 52.6,48 U$7.12 | v49.8,51.7 v49.8,49.3
  Bottom 0.3: v54.3,48 53,49.3 v49.8,49.3 | v49.8,51.7 54.6,56.5 X1.14
N$205  (via drill 0.25)
  Top 0.3: v56.3,53.2 56.3,49.3 52.6,49.3 U$7.13
  Bottom 0.3: v56.3,53.2 57.6,54.5 X1.12
N$206  (via drill 0.25)
  Top 0.3: U$7.14 55.2,50.5 v55.2,51.8
  Bottom 0.3: v55.2,51.8 55.9,52.5 X1.10
N$207  (via drill 0.25)
  Top 0.3: v54.3,51.7 52.6,51.7 U$7.15
  Bottom 0.3: v54.3,51.7 55.5,50.5 X1.8
N$208
  Top 0.3: X1.6 57,49.5 57,53.9 55.6,53.9 55.2,53.5 55.2,53.1 52.6,53.1 U$7.16
N$209  (via drill 0.25)
  Top 0.3: v54.3,54.3 U$7.17 | v50.5,48.6 v50.5,51.1
  Bottom 0.3: v54.3,54.3 51.1,51.1 v50.5,51.1 | v50.5,48.6 52.6,46.5 X1.4
N$210
  Top 0.3: X1.2 59,45.5 59,55.5 52.6,55.5 U$7.18
N$212  (via drill 0.25)
  Top 0.3: 97.7,96 98.4,96 98.6,96.2 98.6,96.9 98.7,97 IC21.2 | 97.7,96 97.7,98.9 99.3,100.5 99.3,106.7 IC21.46 | v96.1,94.4 96.1,93 95,91.9 IC22.1 | v97.5,95.8 97.7,96
  Bottom 0.3: v97.5,95.8 v96.1,94.4
N$213  (via drill 0.25)
  Top 0.3: 96.9,92 96.1,91.2 93.6,91.2 93.6,88.8 94.4,88 IC22.4 | 96.9,92 99.2,94.3 99.2,96.9 99.3,97 IC21.3 | v100.7,108.1 100.7,106.8 IC21.44 | v96.8,106.9 96.8,92.1 96.9,92
  Bottom 0.3: v100.7,108.1 99.5,106.9 v96.8,106.9
N$214  (via drill 0.25)
  Top 0.3: IC21.43 101.2,106.7 101.2,106.1 100.8,105.7 100.8,97.2 100.7,97.1 IC21.5 100.6,96.9 100.5,96.8 100.5,94.6 v97.1,91.2 | v99.5,86 99.5,85.5 101,85.5 IC22.9
  Bottom 0.3: v99.5,86 96.6,88.9 96.6,91.2 v97.1,91.2
N$215  (via drill 0.25)
  Top 0.3: 101.1,95.7 101.1,93.6 99.8,92.3 99.8,91.3 99.9,91.2 102.4,91.2 102.4,90.1 101.6,89.3 101.1,89.3 IC22.12 | 101.1,95.7 101.1,96.9 101.2,97 IC21.6 | v102.6,108.1 102.6,106.8 IC21.41 | v98.9,108.8 97.5,107.4 97.5,105.9 97.4,105.8 97.4,99.8 v97.5,99.7 | v101.2,95.7 101.1,95.7
  Bottom 0.3: v102.6,108.1 101.9,108.8 v98.9,108.8 | v97.5,99.7 101.2,96 v101.2,95.7
N$216  (via drill 0.25)
  Top 0.3: IC21.40 103.1,106.7 103.1,106 102.7,105.6 102.7,97.2 102.6,97.1 IC21.8 102.6,96.9 v102.6,95.7 | v105.2,93.7 107,91.9 IC23.1
  Bottom 0.3: v105.2,93.7 103.2,95.7 v102.6,95.7
N$217  (via drill 0.25)
  Top 0.3: v103.1,91 103.3,91.2 103.3,96.9 103.2,97 IC21.9 | v105.5,88.6 107,88.6 107,88 IC23.4 | v96.1,98.3 96.1,110.6 104,110.6 104.3,110.3 104.3,106.9 104.4,106.8 IC21.38
  Bottom 0.3: v105.5,88.6 v103.1,91 103,91.1 103,91.4 v96.1,98.3
N$218  (via drill 0.25)
  Top 0.3: IC21.37 105.1,106.1 104.6,105.6 104.6,97.2 104.5,97.1 IC21.11 104.5,96.9 104.5,93.3 v105,92.8 | v111.7,86.1 111.7,85.5 113.1,85.5 IC23.9
  Bottom 0.3: v105,92.8 v111.7,86.1
N$219
  Top 0.3: IC21.36 105.7,106.7 105.7,106.1 105.1,105.5 IC21.12 105.1,96.4 108.3,93.2 108.3,91.2 114.3,91.2 114.5,91 114.5,89.3 113.2,89.3 IC23.12
N$220  (via drill 0.25)
  Top 0.3: IC21.13 105.8,97.1 v105.8,102.4 105.8,105.2 106.3,105.7 106.3,106.7 IC21.35 | v87.8,102.4 87.8,104.8 87.2,105.4 IC24.1
  Bottom 0.3: v105.8,102.4 v87.8,102.4
N$221  (via drill 0.25)
  Top 0.3: 107,102.6 107.6,103.2 107.6,106.7 IC21.33 | 107,102.6 106.3,101.9 106.3,97.1 IC21.14 | v91.6,103.1 91.6,104.8 91,105.4 IC24.4 | 107,102.6 v106.5,103.1
  Bottom 0.3: v106.5,103.1 v91.6,103.1
N$222
  Top 0.3: IC21.16 107.7,97.1 107.8,97.2 107.8,102.8 108.2,103.2 108.2,106.7 IC21.32 108.2,106.9 108.2,107.5 107.4,108.3 107.4,112.9 94.4,112.9 94.2,112.7 94.2,112.2 93.6,111.6 IC24.9
N$223  (via drill 0.25)
  Top 0.3: v108.4,95.7 108.4,96.9 108.3,97 IC21.17 | IC21.30 109.5,106.8 109.5,108.1 v108.8,108.1 107.8,109.1 107.8,113.3 91,113.3 90.4,112.7 90.4,112.2 89.8,111.6 IC24.12
  Bottom 0.3: v108.4,95.7 110.4,97.7 111.1,97.7 114.2,100.8 114.2,107.8 109.1,107.8 v108.8,108.1
N$224  (via drill 0.25)
  Top 0.3: 109.4,103.8 109.4,105 110.1,105.7 110.1,106.7 IC21.29 | 109.4,103.8 109.4,97.2 109.5,97.1 IC21.19 | v74.3,104.5 74.3,104.6 75.1,105.4 IC25.1 | v109.6,103.8 109.4,103.8
  Bottom 0.3: v74.3,104.5 97.1,104.5 97.8,103.8 v109.6,103.8
N$225  (via drill 0.25)
  Top 0.3: v110.1,100.3 110.1,97.1 IC21.20 | v113.5,103.7 113.3,103.9 113.3,107.5 113,107.8 111.5,107.8 111.5,106.8 IC21.27 | v83.6,102.7 83.6,103 80.1,103 79.2,103.9 79.2,105.2 79,105.4 IC25.4
  Bottom 0.3: v113.5,103.7 v110.1,100.3 110,100.4 85.9,100.4 v83.6,102.7
N$226  (via drill 0.25)
  Top 0.3: 111.4,105.5 111.4,103.7 111.5,103.6 111.5,97.1 IC21.22 | 111.4,105.5 112,106.1 112,106.7 IC21.26 | v86.3,106.3 82.2,110.4 82.2,110.9 81.6,111.5 IC25.9 | v111.5,105.5 111.4,105.5
  Bottom 0.3: v86.3,106.3 86.4,106.2 110.8,106.2 v111.5,105.5
N$228  (via drill 0.25)
  Top 0.3: v97.3,89.2 95,89.2 IC22.3 | v109.2,87.4 110.8,85.8 110.8,82 112.5,80.3 112.5,79.2 U$9.1
  Bottom 0.3: v97.3,89.2 99.1,87.4 v109.2,87.4